# EAGLE design ETH-IO(RS485-DS18B20-Panel) (EAGLE 9.6.2)
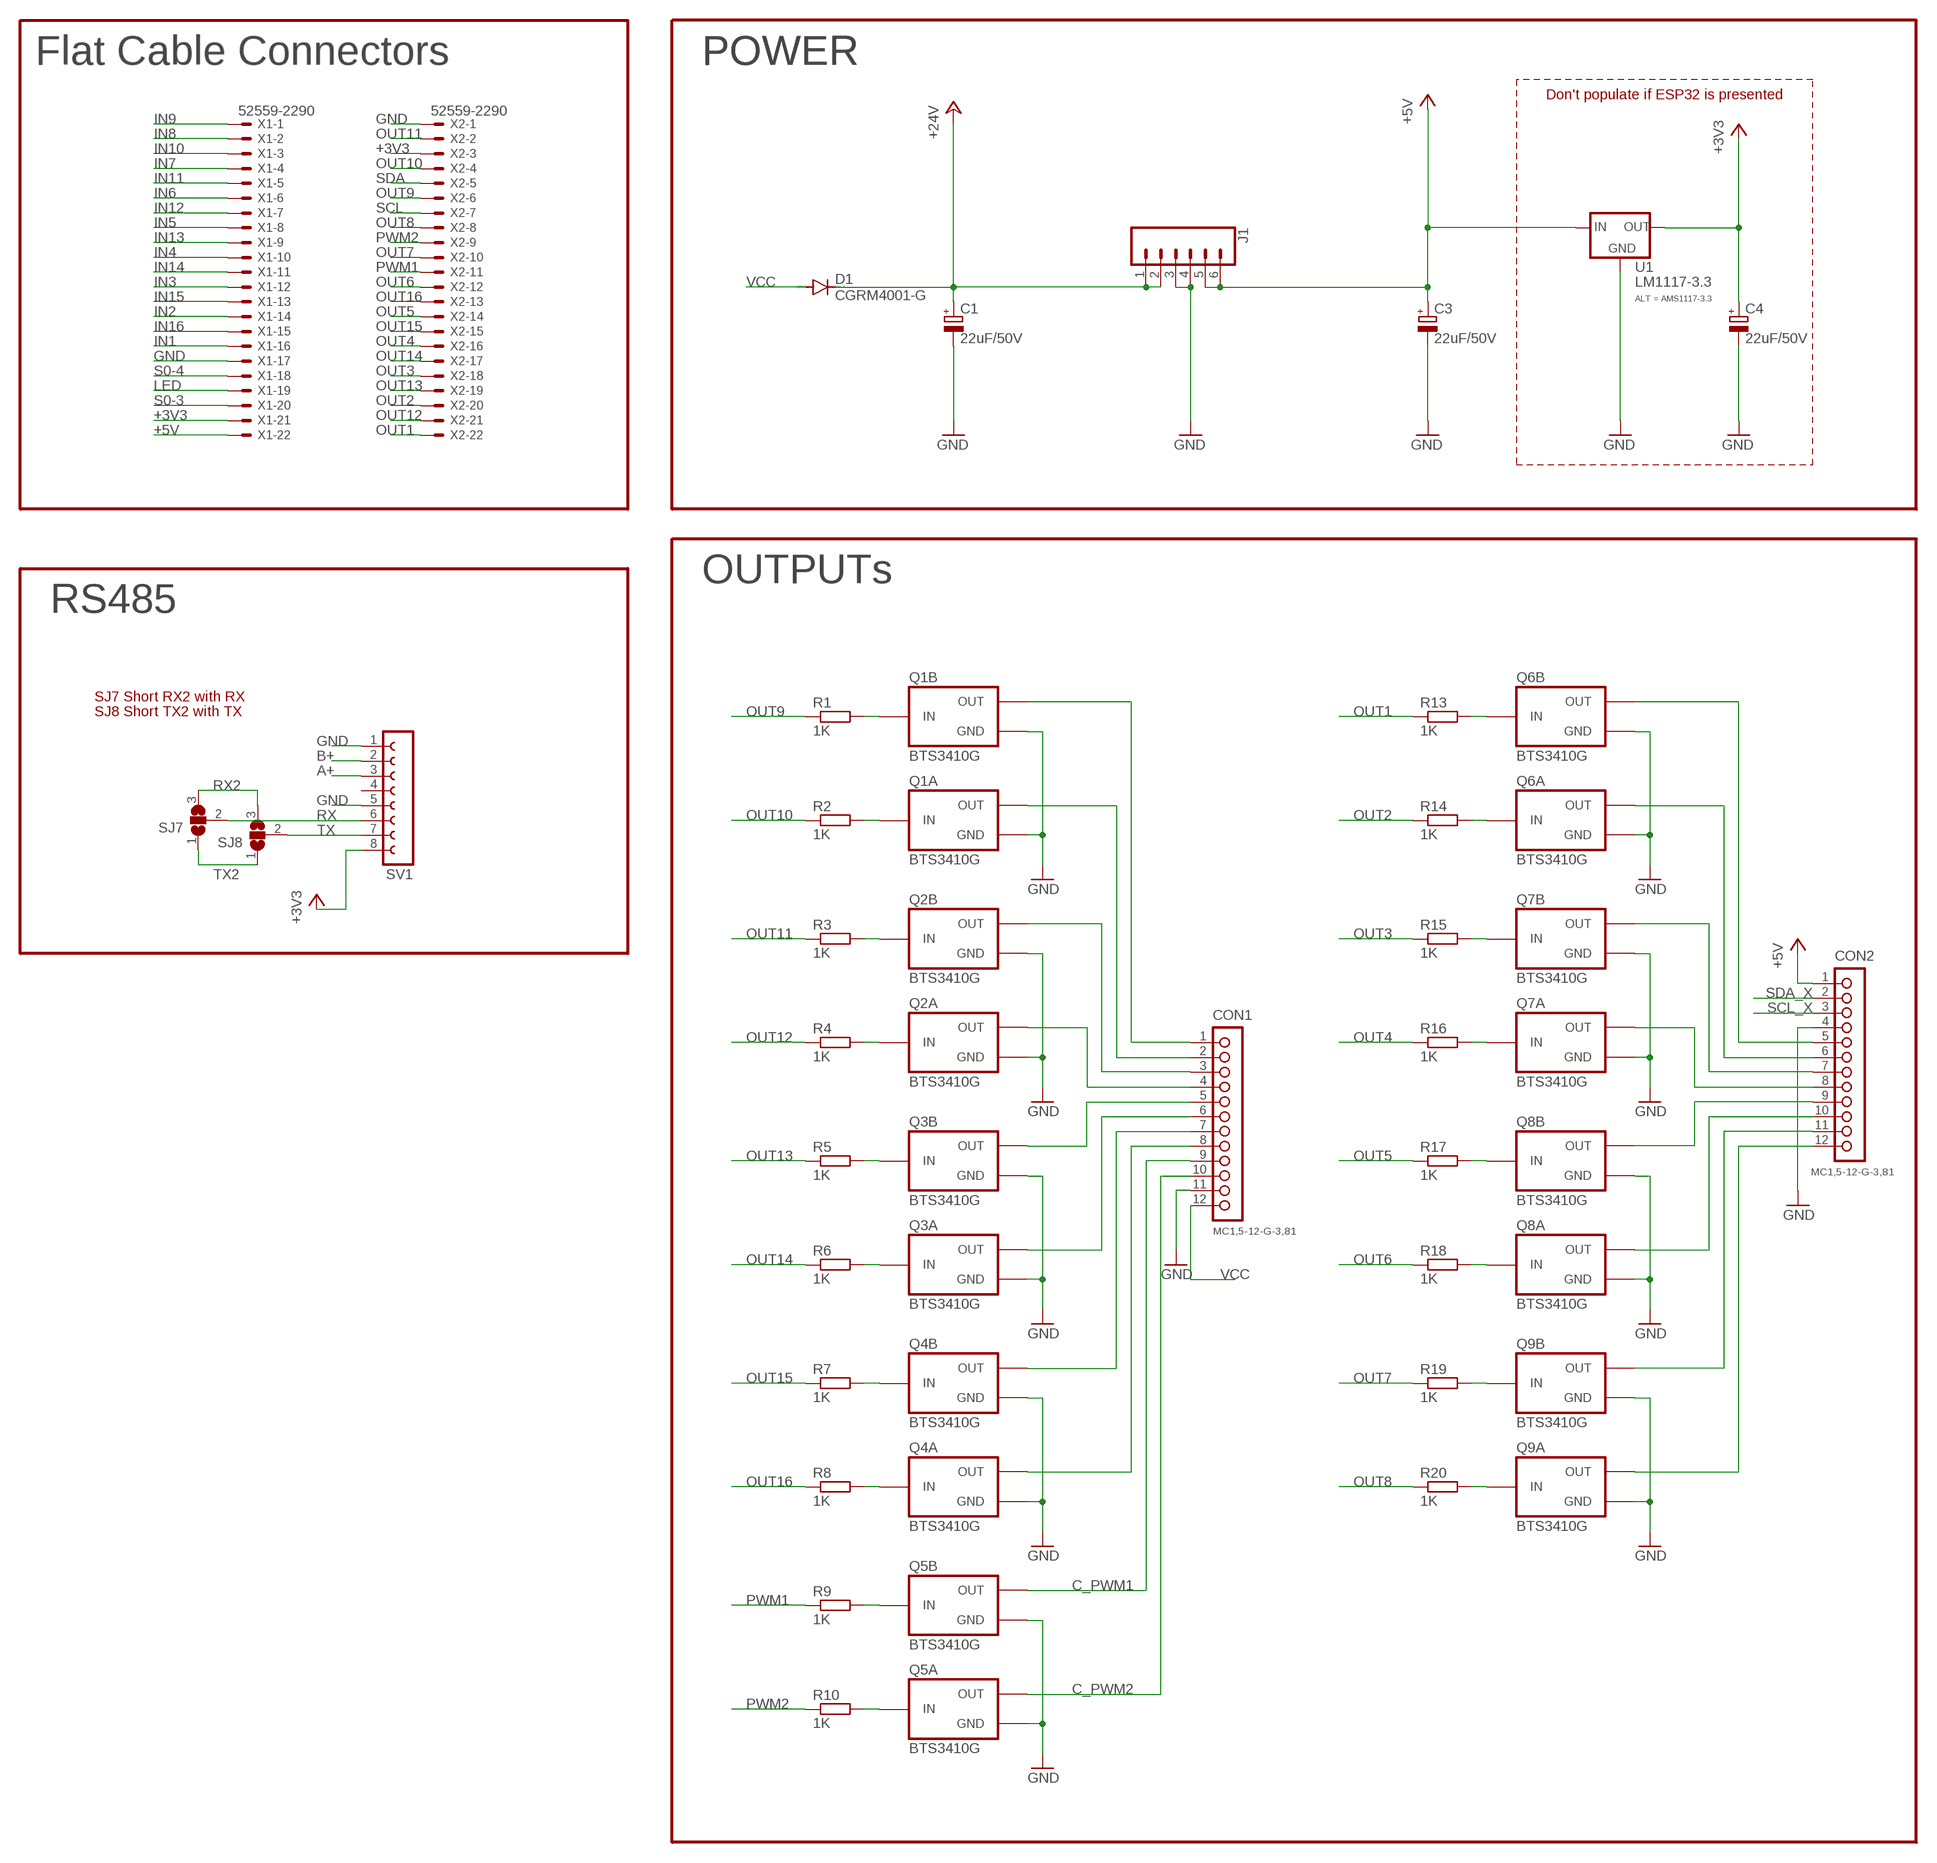
[diagram p0: schematic, sheet 1, part 1 of 2]
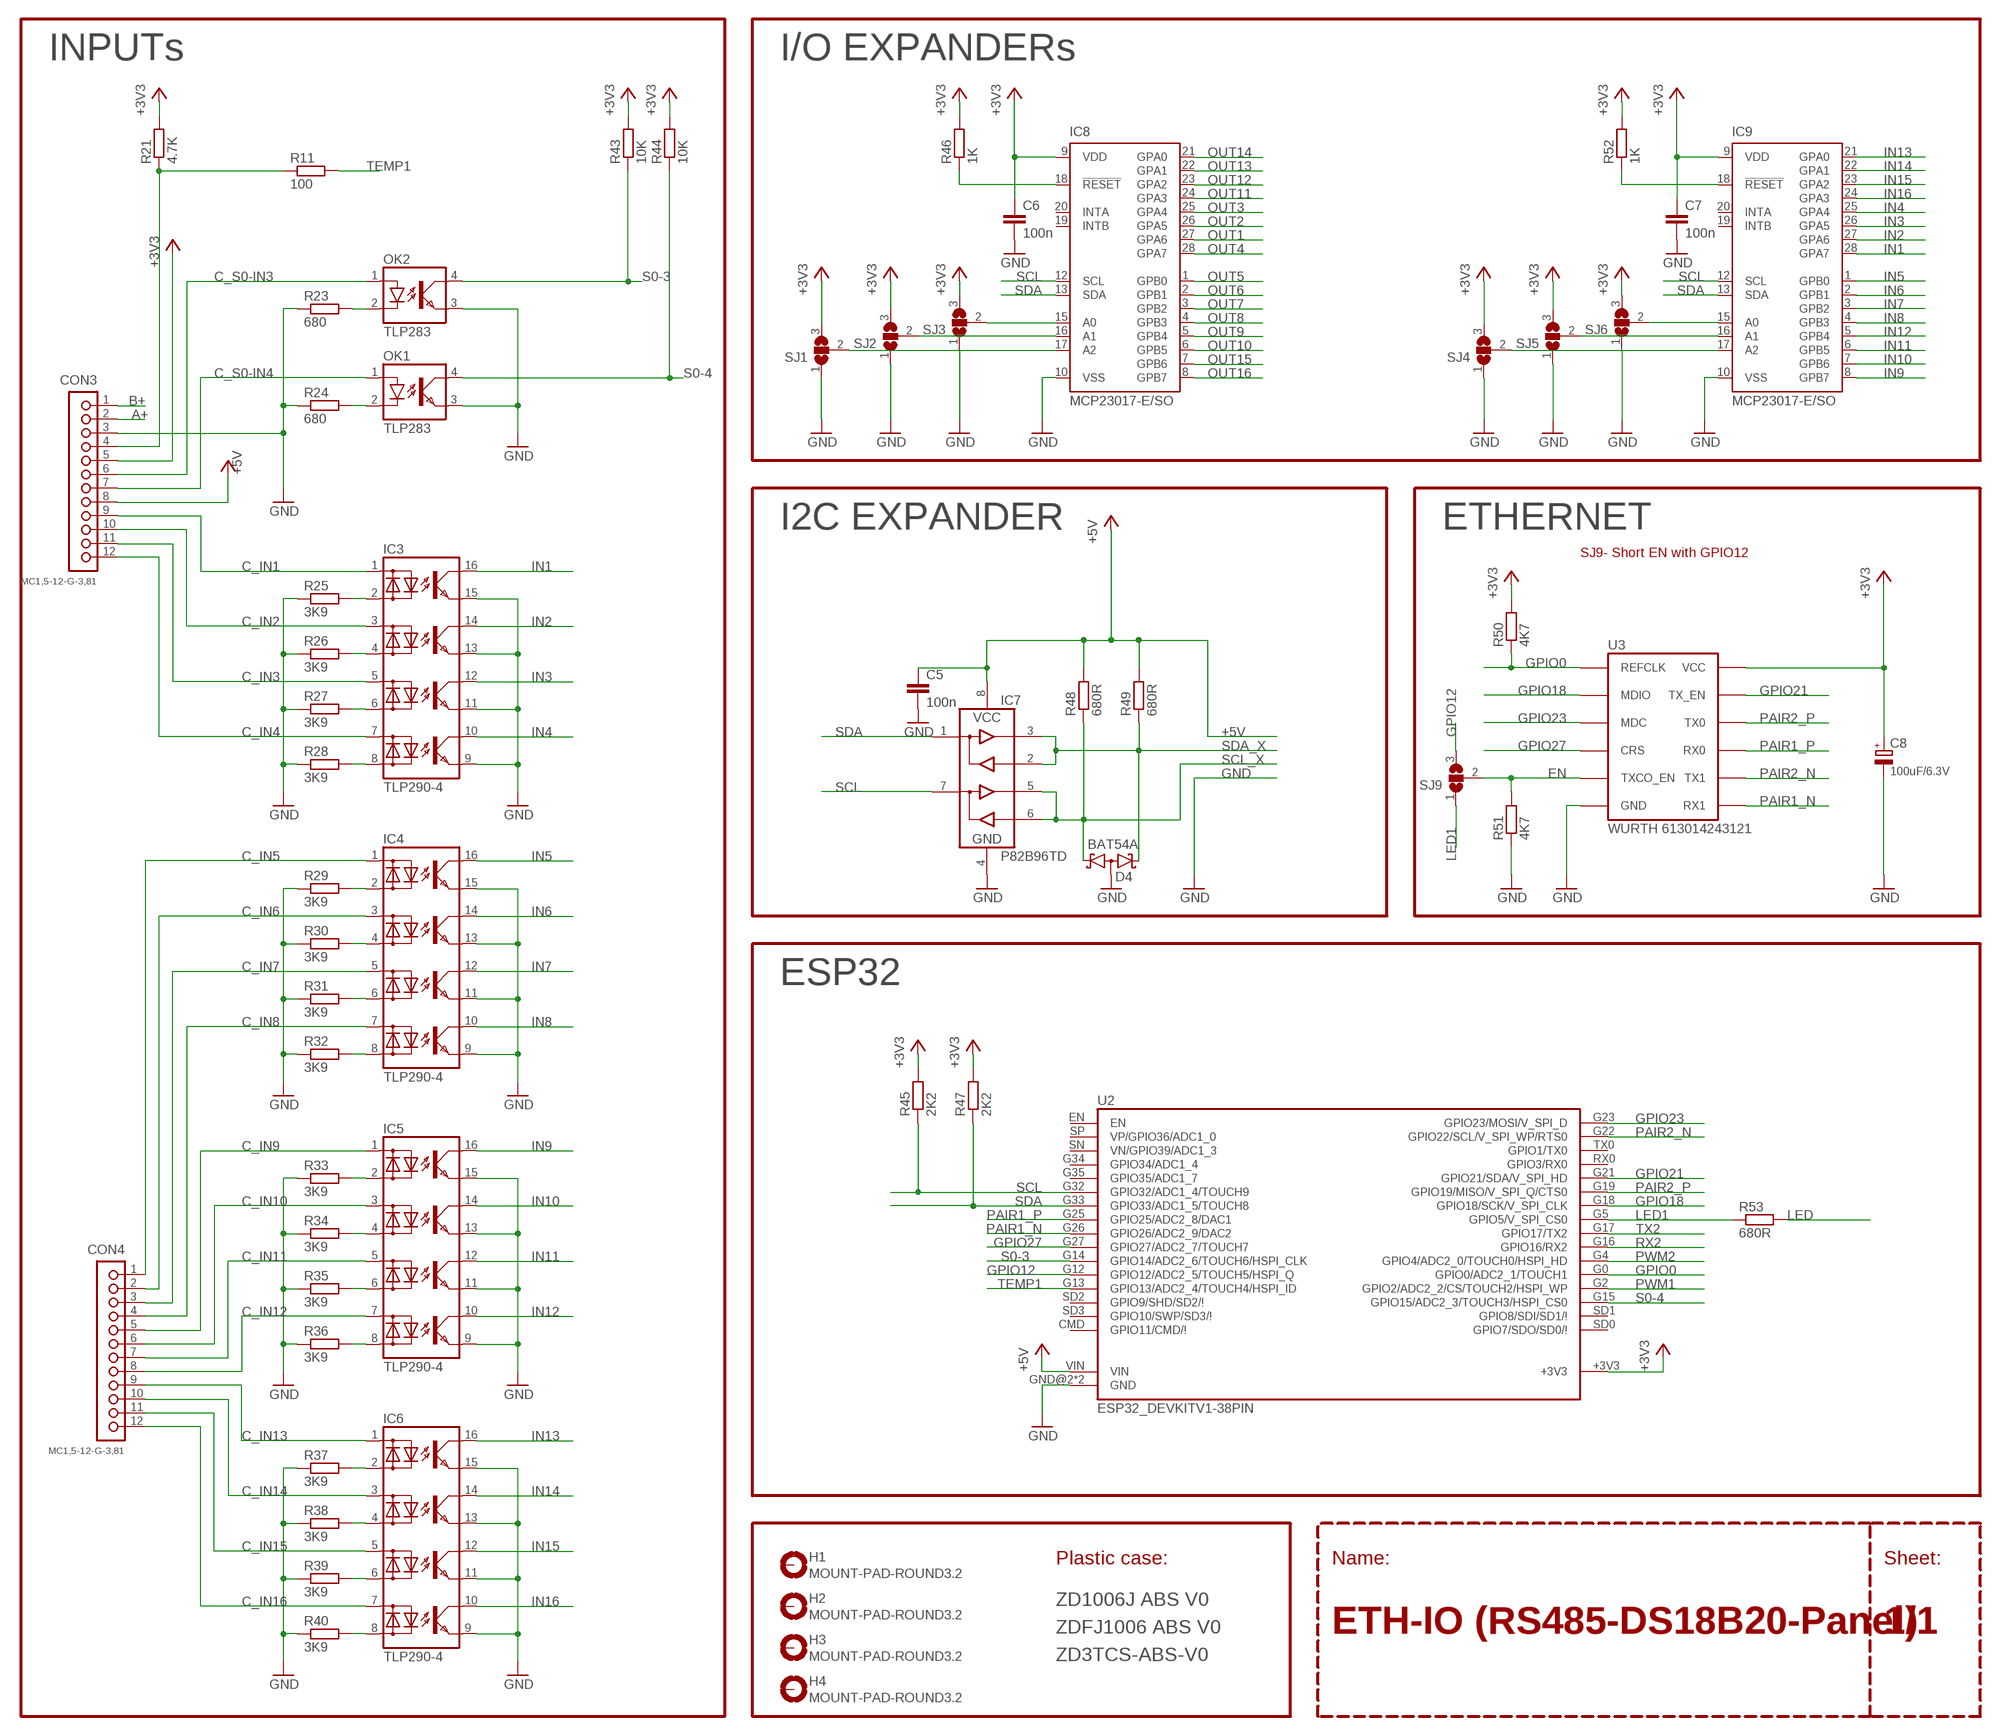
[diagram p1: schematic, sheet 1, part 2 of 2]

## Parts
C1  22uF/50V  CPOL-EUC  [PANASONIC_C]
C3  22uF/50V  CPOL-EUC  [PANASONIC_C]
C4  22uF/50V  CPOL-EUC  [PANASONIC_C]
C5  100n  C-EUC0805  [C0805]
C6  100n  C-EUC0805  [C0805]
C7  100n  C-EUC0805  [C0805]
C8  100uF/6.3V  CPOL-EUC  [PANASONIC_C]
CON1  MC1,5-12-G-3,81  [MC1,5/12-G-3,81]
CON2  MC1,5-12-G-3,81  [MC1,5/12-G-3,81]
CON3  MC1,5-12-G-3,81  [MC1,5/12-G-3,81]
CON4  MC1,5-12-G-3,81  [MC1,5/12-G-3,81]
D1  CGRM4001-G  [SOD-123_MINI-SMA]
D4  BAT54A  [SOT23]
H1  MOUNT-PAD-ROUND3.2  [3,2-PAD]
H2  MOUNT-PAD-ROUND3.2  [3,2-PAD]
H3  MOUNT-PAD-ROUND3.2  [3,2-PAD]
H4  MOUNT-PAD-ROUND3.2  [3,2-PAD]
IC3  TLP290-4  [SO16]
IC4  TLP290-4  [SO16]
IC5  TLP290-4  [SO16]
IC6  TLP290-4  [SO16]
IC7  P82B96TD  [SO08]
IC8  MCP23017-E/SO  MCP23017SO  [SO28W]
IC9  MCP23017-E/SO  MCP23017SO  [SO28W]
J1  CONN_06NO_SILK_FEMALE_PTH  [1X06_NO_SILK]
OK1  TLP283  [MINI-FLAT-4]
OK2  TLP283  [MINI-FLAT-4]
Q1  BTS3410G  [SO8]
Q2  BTS3410G  [SO8]
Q3  BTS3410G  [SO8]
Q4  BTS3410G  [SO8]
Q5  BTS3410G  [SO8]
Q6  BTS3410G  [SO8]
Q7  BTS3410G  [SO8]
Q8  BTS3410G  [SO8]
Q9  BTS3410G  [SO8]
R1  1K  R-EU_R0805  [R0805]
R2  1K  R-EU_R0805  [R0805]
R3  1K  R-EU_R0805  [R0805]
R4  1K  R-EU_R0805  [R0805]
R5  1K  R-EU_R0805  [R0805]
R6  1K  R-EU_R0805  [R0805]
R7  1K  R-EU_R0805  [R0805]
R8  1K  R-EU_R0805  [R0805]
R9  1K  R-EU_R0805  [R0805]
R10  1K  R-EU_R0805  [R0805]
R11  100  R-EU_R0805  [R0805]
R13  1K  R-EU_R0805  [R0805]
R14  1K  R-EU_R0805  [R0805]
R15  1K  R-EU_R0805  [R0805]
R16  1K  R-EU_R0805  [R0805]
R17  1K  R-EU_R0805  [R0805]
R18  1K  R-EU_R0805  [R0805]
R19  1K  R-EU_R0805  [R0805]
R20  1K  R-EU_R0805  [R0805]
R21  4.7K  R-EU_R0805  [R0805]
R23  680  R-EU_R0805  [R0805]
R24  680  R-EU_R0805  [R0805]
R25  3K9  R-EU_R0805  [R0805]
R26  3K9  R-EU_R0805  [R0805]
R27  3K9  R-EU_R0805  [R0805]
R28  3K9  R-EU_R0805  [R0805]
R29  3K9  R-EU_R0805  [R0805]
R30  3K9  R-EU_R0805  [R0805]
R31  3K9  R-EU_R0805  [R0805]
R32  3K9  R-EU_R0805  [R0805]
R33  3K9  R-EU_R0805  [R0805]
R34  3K9  R-EU_R0805  [R0805]
R35  3K9  R-EU_R0805  [R0805]
R36  3K9  R-EU_R0805  [R0805]
R37  3K9  R-EU_R0805  [R0805]
R38  3K9  R-EU_R0805  [R0805]
R39  3K9  R-EU_R0805  [R0805]
R40  3K9  R-EU_R0805  [R0805]
R43  10K  R-EU_R0805  [R0805]
R44  10K  R-EU_R0805  [R0805]
R45  2K2  R-EU_R0805  [R0805]
R46  1K  R-EU_R0805  [R0805]
R47  2K2  R-EU_R0805  [R0805]
R48  680R  R-EU_R0805  [R0805]
R49  680R  R-EU_R0805  [R0805]
R50  4K7  R-EU_R0805  [R0805]
R51  4K7  R-EU_R0805  [R0805]
R52  1K  R-EU_R0805  [R0805]
R53  680R  R-EU_R0805  [R0805]
SJ1  SJ2W  [SJ_2]
SJ2  SJ2W  [SJ_2]
SJ3  SJ2W  [SJ_2]
SJ4  SJ2W  [SJ_2]
SJ5  SJ2W  [SJ_2]
SJ6  SJ2W  [SJ_2]
SJ7  SJ2W  [SJ_2]
SJ8  SJ2W  [SJ_2]
SJ9  SJ2W  [SJ_2]
SV1  FE08-1  [FE08]
U1  LM1117-3.3  [SOT223]
U2  ESP32_DEVKITV1-38PIN  [ESP32_DEVKITV1_38PIN]
U3  WURTH 613014243121  LAN8720_ETH_BOARD  [LAN8720_ETH_BOARD]
X1  52559-2290  [52559-2290]
X2  52559-2290  [52559-2290]

## Nets
+3V3 [PWR]: C4.+ C6.1 C7.1 C8.+ CON3.5 IC8.9(VDD) IC9.9(VDD) R21.2 R43.2 R44.2 R45.2 R46.2 R47.2 R50.2 R52.2 SJ1.3 SJ2.3 SJ3.3 SJ4.3 SJ5.3 SJ6.3 SV1.8 U1.2(OUT) U1.4(OUT) U2.+3V3 U3.VCC U3.VCC@1(VCC) X1.21 X2.3
+5V [PWR]: C3.+ C5.1 CON2.1 CON3.8 IC7.8(VCC) J1.5 J1.6 R48.2 R49.2 U1.3(IN) U2.VIN X1.22
+24V [PWR]: C1.+ D1.C J1.1 J1.2
A+: CON3.2 SV1.3
B+: CON3.1 SV1.2
C_IN1: CON3.9 IC3.1(A1)
C_IN2: CON3.10 IC3.3(A2)
C_IN3: CON3.11 IC3.5(A3)
C_IN4: CON3.12 IC3.7(A4)
C_IN5: CON4.1 IC4.1(A1)
C_IN6: CON4.2 IC4.3(A2)
C_IN7: CON4.3 IC4.5(A3)
C_IN8: CON4.4 IC4.7(A4)
C_IN9: CON4.5 IC5.1(A1)
C_IN10: CON4.6 IC5.3(A2)
C_IN11: CON4.7 IC5.5(A3)
C_IN12: CON4.8 IC5.7(A4)
C_IN13: CON4.9 IC6.1(A1)
C_IN14: CON4.10 IC6.3(A2)
C_IN15: CON4.11 IC6.5(A3)
C_IN16: CON4.12 IC6.7(A4)
C_OUT1: CON2.5 Q6.5(B:OUT) Q6.6(B:OUT)
C_OUT2: CON2.6 Q6.7(A:OUT) Q6.8(A:OUT)
C_OUT3: CON2.7 Q7.5(B:OUT) Q7.6(B:OUT)
C_OUT4: CON2.8 Q7.7(A:OUT) Q7.8(A:OUT)
C_OUT5: CON2.9 Q8.5(B:OUT) Q8.6(B:OUT)
C_OUT6: CON2.10 Q8.7(A:OUT) Q8.8(A:OUT)
C_OUT7: CON2.11 Q9.5(B:OUT) Q9.6(B:OUT)
C_OUT8: CON2.12 Q9.7(A:OUT) Q9.8(A:OUT)
C_OUT9: CON1.1 Q1.5(B:OUT) Q1.6(B:OUT)
C_OUT10: CON1.2 Q1.7(A:OUT) Q1.8(A:OUT)
C_OUT11: CON1.3 Q2.5(B:OUT) Q2.6(B:OUT)
C_OUT12: CON1.4 Q2.7(A:OUT) Q2.8(A:OUT)
C_OUT13: CON1.5 Q3.5(B:OUT) Q3.6(B:OUT)
C_OUT14: CON1.6 Q3.7(A:OUT) Q3.8(A:OUT)
C_OUT15: CON1.7 Q4.5(B:OUT) Q4.6(B:OUT)
C_OUT16: CON1.8 Q4.7(A:OUT) Q4.8(A:OUT)
C_PWM1: CON1.9 Q5.5(B:OUT) Q5.6(B:OUT)
C_PWM2: CON1.10 Q5.7(A:OUT) Q5.8(A:OUT)
C_S0-IN3: CON3.6 OK2.1(A)
C_S0-IN4: CON3.7 OK1.1(A)
EN: R51.2 SJ9.2 U3.TXCO_EN
GND [PWR]: C1.- C3.- C4.- C5.2 C6.2 C7.2 C8.- CON1.11 CON2.4 CON3.3 D4.3(AA) IC3.9(EMIT4) IC3.11(EMIT3) IC3.13(EMIT2) IC3.15(EMIT1) IC4.9(EMIT4) IC4.11(EMIT3) IC4.13(EMIT2) IC4.15(EMIT1) IC5.9(EMIT4) IC5.11(EMIT3) IC5.13(EMIT2) IC5.15(EMIT1) IC6.9(EMIT4) IC6.11(EMIT3) IC6.13(EMIT2) IC6.15(EMIT1) IC7.4(GND) IC8.10(VSS) IC9.10(VSS) J1.3 J1.4 OK1.3(EMIT) OK2.3(EMIT) Q1.1(A:GND) Q1.3(B:GND) Q2.1(A:GND) Q2.3(B:GND) Q3.1(A:GND) Q3.3(B:GND) Q4.1(A:GND) Q4.3(B:GND) Q5.1(A:GND) Q5.3(B:GND) Q6.1(A:GND) Q6.3(B:GND) Q7.1(A:GND) Q7.3(B:GND) Q8.1(A:GND) Q8.3(B:GND) Q9.1(A:GND) Q9.3(B:GND) R23.1 R24.1 R25.1 R26.1 R27.1 R28.1 R29.1 R30.1 R31.1 R32.1 R33.1 R34.1 R35.1 R36.1 R37.1 R38.1 R39.1 R40.1 R51.1 SJ1.1 SJ2.1 SJ3.1 SJ4.1 SJ5.1 SJ6.1 SV1.1 SV1.5 U1.1(GND) U2.GND@2(GND) U2.GND@3(GND) U3.GND U3.GND@1(GND) X1.17 X2.1
GPIO0: R50.1 U2.G0(GPIO0/ADC2_1/TOUCH1) U3.INT(REFCLK)
GPIO12: SJ9.3 U2.G12(GPIO12/ADC2_5/TOUCH5/HSPI_Q)
GPIO18 [ETH]: U2.G18(GPIO18/SCK/V_SPI_CLK) U3.MDIO
GPIO21 [ETH]: U2.G21(GPIO21/SDA/V_SPI_HD) U3.TX_EN
GPIO23 [ETH]: U2.G23(GPIO23/MOSI/V_SPI_D) U3.MDC
GPIO27 [ETH]: U2.G27(GPIO27/ADC2_7/TOUCH7) U3.CRS
IN1: IC3.16(COL1) IC9.28(GPA7) X1.16
IN2: IC3.14(COL2) IC9.27(GPA6) X1.14
IN3: IC3.12(COL3) IC9.26(GPA5) X1.12
IN4: IC3.10(COL4) IC9.25(GPA4) X1.10
IN5: IC4.16(COL1) IC9.1(GPB0) X1.8
IN6: IC4.14(COL2) IC9.2(GPB1) X1.6
IN7: IC4.12(COL3) IC9.3(GPB2) X1.4
IN8: IC4.10(COL4) IC9.4(GPB3) X1.2
IN9: IC5.16(COL1) IC9.8(GPB7) X1.1
IN10: IC5.14(COL2) IC9.7(GPB6) X1.3
IN11: IC5.12(COL3) IC9.6(GPB5) X1.5
IN12: IC5.10(COL4) IC9.5(GPB4) X1.7
IN13: IC6.16(COL1) IC9.21(GPA0) X1.9
IN14: IC6.14(COL2) IC9.22(GPA1) X1.11
IN15: IC6.12(COL3) IC9.23(GPA2) X1.13
IN16: IC6.10(COL4) IC9.24(GPA3) X1.15
LED [PWR]: R53.2 X1.19
LED1: R53.1 SJ9.1 U2.G5(GPIO5/V_SPI_CS0)
N$1: IC9.15(A0) SJ6.2
N$2: IC8.16(A1) SJ2.2
N$3: Q1.2(A:IN) R2.2
N$4: Q1.4(B:IN) R1.2
N$5: IC8.18(!RESET) R46.1
N$6: IC9.18(!RESET) R52.1
N$7: IC8.15(A0) SJ3.2
N$8: Q5.4(B:IN) R9.2
N$9: Q5.2(A:IN) R10.2
N$10: IC9.16(A1) SJ5.2
N$11: IC3.2(C1) R25.2
N$12: IC3.4(C2) R26.2
N$13: IC3.6(C3) R27.2
N$14: IC3.8(C4) R28.2
N$15: IC4.2(C1) R29.2
N$16: IC4.4(C2) R30.2
N$17: IC4.6(C3) R31.2
N$18: IC4.8(C4) R32.2
N$19: IC5.2(C1) R33.2
N$20: IC5.4(C2) R34.2
N$21: IC5.6(C3) R35.2
N$22: IC5.8(C4) R36.2
N$23: IC6.2(C1) R37.2
N$24: IC6.4(C2) R38.2
N$25: IC6.6(C3) R39.2
N$26: IC6.8(C4) R40.2
N$27: IC9.17(A2) SJ4.2
N$28: Q2.4(B:IN) R3.2
N$29: Q2.2(A:IN) R4.2
N$30: IC8.17(A2) SJ1.2
N$31: OK2.2(C) R23.2
N$32: Q3.4(B:IN) R5.2
N$33: Q3.2(A:IN) R6.2
N$34: CON3.4 R11.1 R21.1
N$36: Q4.4(B:IN) R7.2
N$37: Q4.2(A:IN) R8.2
N$40: Q6.4(B:IN) R13.2
N$41: Q6.2(A:IN) R14.2
N$44: Q7.4(B:IN) R15.2
N$45: Q7.2(A:IN) R16.2
N$48: Q8.4(B:IN) R17.2
N$49: Q8.2(A:IN) R18.2
N$52: Q9.4(B:IN) R19.2
N$53: Q9.2(A:IN) R20.2
N$57: OK1.2(C) R24.2
OUT1: IC8.27(GPA6) R13.1 X2.22
OUT2: IC8.26(GPA5) R14.1 X2.20
OUT3: IC8.25(GPA4) R15.1 X2.18
OUT4: IC8.28(GPA7) R16.1 X2.16
OUT5: IC8.1(GPB0) R17.1 X2.14
OUT6: IC8.2(GPB1) R18.1 X2.12
OUT7: IC8.3(GPB2) R19.1 X2.10
OUT8: IC8.4(GPB3) R20.1 X2.8
OUT9: IC8.5(GPB4) R1.1 X2.6
OUT10: IC8.6(GPB5) R2.1 X2.4
OUT11: IC8.24(GPA3) R3.1 X2.2
OUT12: IC8.23(GPA2) R4.1 X2.21
OUT13: IC8.22(GPA1) R5.1 X2.19
OUT14: IC8.21(GPA0) R6.1 X2.17
OUT15: IC8.7(GPB6) R7.1 X2.15
OUT16: IC8.8(GPB7) R8.1 X2.13
PAIR1_N [RMII-RX]: U2.G26(GPIO26/ADC2_9/DAC2) U3.RX1
PAIR1_P [RMII-RX]: U2.G25(GPIO25/ADC2_8/DAC1) U3.RX0
PAIR2_N [RMII-TX]: U2.G22(GPIO22/SCL/V_SPI_WP/RTS0) U3.TX1
PAIR2_P [RMII-TX]: U2.G19(GPIO19/MISO/V_SPI_Q/CTS0) U3.TX0
PWM1: R9.1 U2.G2(GPIO2/ADC2_2/CS/TOUCH2/HSPI_WP) X2.11
PWM2: R10.1 U2.G4(GPIO4/ADC2_0/TOUCH0/HSPI_HD) X2.9
RX: SJ7.2 SV1.6
RX2: SJ7.3 SJ8.3 U2.G16(GPIO16/RX2)
S0-3: OK2.4(COL) R43.1 U2.G14(GPIO14/ADC2_6/TOUCH6/HSPI_CLK) X1.20
S0-4: OK1.4(COL) R44.1 U2.G15(GPIO15/ADC2_3/TOUCH3/HSPI_CS0) X1.18
SCL [I2C]: IC7.7(SY) IC8.12(SCL) IC9.12(SCL) R45.1 U2.G32(GPIO32/ADC1_4/TOUCH9) X2.7
SCL_X [I2C_DIFF]: CON2.3 D4.1(K1) IC7.5(TY) IC7.6(RY) R48.1
SDA [I2C]: IC7.1(SX) IC8.13(SDA) IC9.13(SDA) R47.1 U2.G33(GPIO33/ADC1_5/TOUCH8) X2.5
SDA_X [I2C_DIFF]: CON2.2 D4.2(K2) IC7.2(RX) IC7.3(TX) R49.1
TEMP1: R11.2 U2.G13(GPIO13/ADC2_4/TOUCH4/HSPI_ID)
TX: SJ8.2 SV1.7
TX2 [ETH]: SJ7.1 SJ8.1 U2.G17(GPIO17/TX2)
VCC [PWR]: CON1.12 D1.A
Unconnected: H1.B3,2(MOUNT) H2.B3,2(MOUNT) H3.B3,2(MOUNT) H4.B3,2(MOUNT) IC8.19(INTB) IC8.20(INTA) IC9.19(INTB) IC9.20(INTA) SV1.4 U2.CMD(GPIO11/CMD/!) U2.EN U2.G34(GPIO34/ADC1_4) U2.G35(GPIO35/ADC1_7) U2.RX0(GPIO3/RX0) U2.SD0(GPIO7/SDO/SD0/!) U2.SD1(GPIO8/SDI/SD1/!) U2.SD2(GPIO9/SHD/SD2/!) U2.SD3(GPIO10/SWP/SD3/!) U2.SN(VN/GPIO39/ADC1_3) U2.SP(VP/GPIO36/ADC1_0) U2.TX0(GPIO1/TX0)

## Notes on the sheet
- Flat Cable Connectors | POWER | POWER | INPUTs | I/O EXPANDERs
- Don't populate if ESP32 is presented
- I2C EXPANDER | ETHERNET
- OUTPUTs
- SJ9- Short EN with GPIO12
- RS485
- SJ7 Short RX2 with RX
- SJ8 Short TX2 with TX
- ESP32
- Plastic case: | Name: | Sheet:
- ZD1006J ABS V0
- ZDFJ1006 ABS V0 | ETH-IO (RS485-DS18B20-Panel)
- ZD3TCS-ABS-V0

## Library data of the parts
C1 C3 C4 C8 = rcl:CPOL-EU: POLARIZED CAPACITOR, European symbol; SPICEPREFIX: C
C5-C7 = rcl:C-EU: CAPACITOR, European symbol; SPICEPREFIX: C
CON1-CON4 = my-con-terminal:MC1,5-12-G-?: 12P PCB plug-in terminal
D1 = diode:CGRM400*-G: Molded plasitc,JEDEC SOD-123/Mini SMA Source: Comchip CGRM4001-G.pdf
D4 = diode:BAT54A: Schottky Diodes Source: Fairchild .. BAT54.pdf
H1-H4 = holes:MOUNT-PAD-ROUND: MOUNTING PAD, round
IC3-IC6 = my-opto:TLP290-4: Quad Channel Optocoupler with diode
IC7 = my-ic:P82B96?: Dual bidirectional bus buffer; MSL: 1
IC8 IC9 = microchip:MCP23017: http://ww1.microchip.com/downloads/en/DeviceDoc/21952a.pdf Source: http://ww1.microchip.com/downloads/en/DeviceDoc/21952a.pdf; MF: MICROCHIP; MPN: MCP23017-E/SO; OC_FARNELL: 1332087; OC_NEWARK: 31K2958
J1 = SparkFun-Connectors:CONN_06: Multi connection point. Often used as Generic Header-pin footprint for 0.1 inch spaced/style header connections On any of the 0.1 inch spaced packages, you can populate with these: Break Away Headers - Straight <https://www.sparkfun.com/products/116> (PRT-00116) Break Away Male Headers - Right Angle <https://www.sparkfun.com/products/553> (PRT-00553) Female Headers <https://www.sparkfun.com/products/115> (PRT-00115) Break Away Headers - Machine Pin <https://www.sparkfun.com/products/117> (PRT-00117) Break Away Female Headers - Swiss Machine Pin <https://www.sparkfun.com/products/743> (PRT-00743) Arduino Stackable Header - 6 Pin <https://www.sparkfun.com/products/9280> (PRT-09280) Screw Terminals 2.54mm Pitch (6-Pin) <https://www.sparkfun.com/products/16499> (PRT-16499) For SCREWTERMINALS and SPRING TERMINALS visit here: Screw Terimnals on SparkFun.com <https://www.sparkfun.com/search/results?term=Screw+Terminals> (5mm/3.5mm/2.54mm spacing) This device is also useful as a general connection point to wire up your design to another part of your project. Our various solder wires solder well into these plated through hole pads. Hook-Up Wire - Assortment (Stranded, 22 AWG) <https://www.sparkfun.com/products/11375> (PRT-11375) Hook-Up Wire - Assortment (Solid Core, 22 AWG) <https://www.sparkfun.com/products/11367> (PRT-11367) View the entire wire category on our website here <https://www.sparkfun.com/categories/141>; PROD_ID: CONN-08437
OK1 OK2 = optocoupler:TLP283: TOSHIBA PHOTOCOUPLER GaAs IRED & PHOTO-TRANSISTOR Source: http://www.semicon.toshiba.co.jp/td/en/Opto/Photocoupler/en_20050928_TLP283_datasheet.pdf; OC_FARNELL: unknown; OC_NEWARK: unknown
Q1-Q9 = my-load-switch:BTS3410G: Smart Low Side Power Switch
R1-R11 R13-R21 R23-R40 R43-R53 = rcl:R-EU_: RESISTOR, European symbol; SPICEPREFIX: R
SJ1-SJ9 = jumper:SJ2W: SMD solder JUMPER
SV1 = con-lsta:FE08-1: FEMALE HEADER; OC_FARNELL: unknown; OC_NEWARK: unknown
U1 = my-power:LM1117-*: LDO regulator; ALT: AMS1117-3.3
U2 = tmp:ESP32_DEVKITV1-38PIN
U3 = my-modules:LAN8720_ETH_BOARD
X1 X2 = con-molex:52559-2290: FFC/FPC-to-Board 0.50mm (.020") SMT, Vertical, ZIF Receptacle Source: http://www.molex.com/product/ffc/52559.html; MF: MOLEX; MPN: 52559-2290; OC_FARNELL: unknown; OC_NEWARK: 92M6193

## Net classes
0 default: width 0.254 mm, drill 0.5 mm
1 ETH: width 0.254 mm, drill 0.35 mm
2 RMII-TX: width 0.254 mm, drill 0.35 mm
3 RMII-RX: width 0.254 mm, drill 0.35 mm
4 I2C: width 0.254 mm, drill 0.35 mm
5 PWR: width 0.305 mm, drill 0.5 mm
6 I2C_DIFF: width 0.254 mm, drill 0.5 mm

## Board
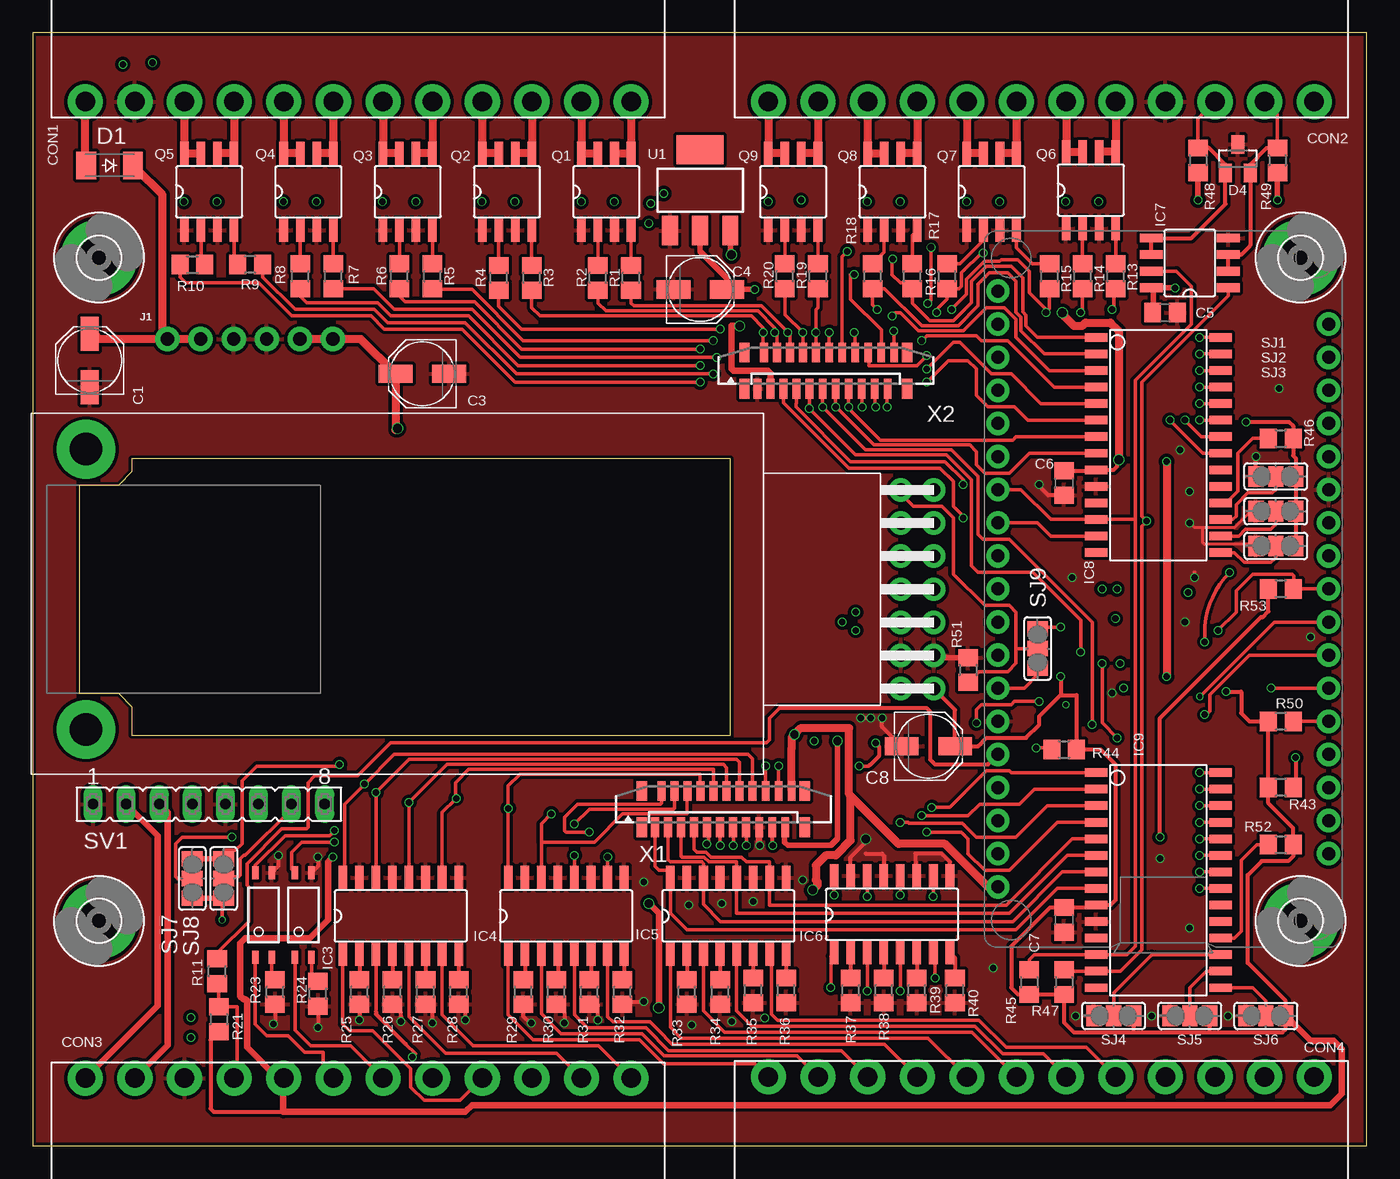
[diagram p2: board, top side]
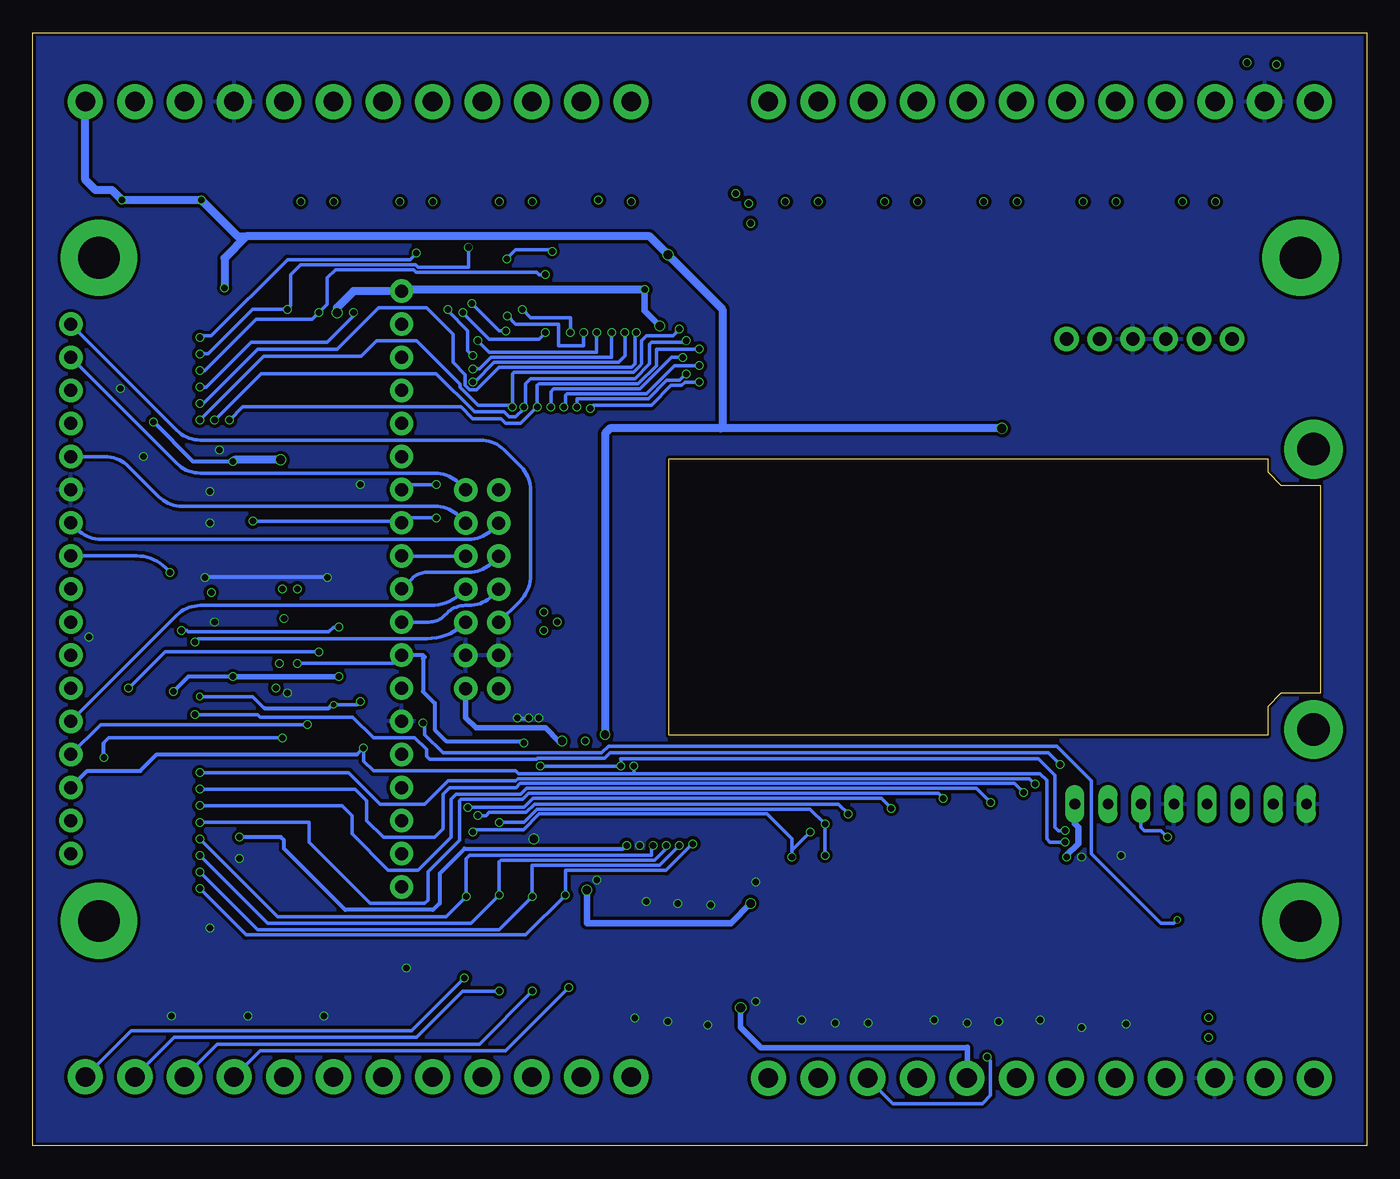
[diagram p3: board, bottom side, seen from below]

Size 102.45 x 85.45 mm. Coordinates in mm from the lower left corner, seen from the top.
Outline: 0,85.45 0,0 102.45,0 102.45,85.45 0,85.45
Copper layers (1*16): Top 0.035mm / dielectric 1.6mm / Bottom 0.035mm
Design rules "jlcpcb-2layers": minimum track width 5mil, minimum drill 0.3mm, track to track 5mil, track to pad 5mil, pad to pad 5mil, via to via 5mil, smd to smd 5mil, copper to edge 0.2mm, drill to drill 6mil, minimum pad ring 10mil, minimum via ring 3mil, stop-mask expansion 4mil, vias tented up to drill 0mil, thermal gap 10mil

### Footprints (pad centres in the part's own frame; a part is rotated, then mirrored left to right if it is on the bottom)
PANASONIC_C = smd 2.6 x 1.4: + 2.05,0; - -2.05,0
C0805 = smd 1.3 x 1.5: 1 -0.95,0; 2 0.95,0
MC1,5/12-G-3,81 = drill 1.5: 1 -20.955,8; 2 -17.145,8; 3 -13.335,8; 4 -9.525,8; 5 -5.715,8; 6 -1.905,8; 7 1.905,8; 8 5.715,8; 9 9.525,8; 10 13.335,8; 11 17.145,8; 12 20.955,8
SOD-123_MINI-SMA = smd 1.5 x 2.1: A 1.8,0; C -1.8,0
SOT23 = smd 1 x 1.4: 1 -0.95,-1.1; 2 0.95,-1.1; 3 0,1.1
3,2-PAD = drill 3.2 pad 5.842: B3,2 0,0
SO16 = smd 0.66 x 1.778: 1 -4.445,-2.946; 2 -3.175,-2.946; 3 -1.905,-2.946; 4 -0.635,-2.946; 5 0.635,-2.946; 6 1.905,-2.946; 7 3.175,-2.946; 8 4.445,-2.946; 9 4.445,2.946; 10 3.175,2.946; 11 1.905,2.946; 12 0.635,2.946; 13 -0.635,2.946; 14 -1.905,2.946; 15 -3.175,2.946; 16 -4.445,2.946
SO08 = smd 0.66 x 1.778: 1 -1.905,-2.946; 2 -0.635,-2.946; 3 0.635,-2.946; 4 1.905,-2.946; 5 1.905,2.946; 6 0.635,2.946; 7 -0.635,2.946; 8 -1.905,2.946
SO28W = smd 0.65 x 1.7: 1 -7.62,-4.78; 2 -6.35,-4.78; 3 -5.08,-4.78; 4 -3.81,-4.78; 5 -2.54,-4.78; 6 -1.27,-4.78; 7 0,-4.78; 8 1.27,-4.78; 9 2.54,-4.78; 10 3.81,-4.78; 11 5.08,-4.78; 12 6.35,-4.78; 13 7.62,-4.78; 14 8.89,-4.78; 15 8.89,4.78; 16 7.62,4.78; 17 6.35,4.78; 18 5.08,4.78; 19 3.81,4.78; 20 2.54,4.78; 21 1.27,4.78; 22 0,4.78; 23 -1.27,4.78; 24 -2.54,4.78; 25 -3.81,4.78; 26 -5.08,4.78; 27 -6.35,4.78; 28 -7.62,4.78
1X06_NO_SILK = drill 1.016 pad 1.88: 1 0,0; 2 2.54,0; 3 5.08,0; 4 7.62,0; 5 10.16,0; 6 12.7,0
MINI-FLAT-4 = smd 1 x 0.5: 1 -3.24,0.635; 2 -3.24,-0.635; 3 3.24,-0.635; 4 3.24,0.635
SO8 = smd 0.66 x 1.778: 1 -1.905,-2.946; 2 -0.635,-2.946; 3 0.635,-2.946; 4 1.905,-2.946; 5 1.905,2.946; 6 0.635,2.946; 7 -0.635,2.946; 8 -1.905,2.946
R0805 = smd 1.3 x 1.5: 1 -0.95,0; 2 0.95,0
SJ_2 = smd 1.168 x 1.6: 1 -1.524,0; 2 0,0; 3 1.524,0
FE08 = drill 0.813 long: 1 -8.89,0; 2 -6.35,0; 3 -3.81,0; 4 -1.27,0; 5 1.27,0; 6 3.81,0; 7 6.35,0; 8 8.89,0
SOT223 = smd 1.219 x 2.235: 1 -2.311,-3.099; 2 0,-3.099; 3 2.311,-3.099 | smd 3.6 x 2.2: 4 0,3.099
ESP32_DEVKITV1_38PIN = drill 1: +3V3 -12.7,22.86; CMD -12.7,-20.32; EN -12.7,20.32; G0 12.7,-10.16; G2 12.7,-12.7; G4 12.7,-7.62; G5 12.7,0; G12 -12.7,-7.62; G13 -12.7,-12.7; G14 -12.7,-5.08; G15 12.7,-15.24; G16 12.7,-5.08; G17 12.7,-2.54; G18 12.7,2.54; G19 12.7,5.08; G21 12.7,10.16; G22 12.7,17.78; G23 12.7,20.32; G25 -12.7,2.54; G26 -12.7,0; G27 -12.7,-2.54; G32 -12.7,7.62; G33 -12.7,5.08; G34 -12.7,12.7; G35 -12.7,10.16; GND@2 12.7,7.62; GND@3 -12.7,-10.16; RX0 12.7,12.7; SD0 12.7,-20.32; SD1 12.7,-17.78; SD2 -12.7,-15.24; SD3 -12.7,-17.78; SN -12.7,15.24; SP -12.7,17.78; TX0 12.7,15.24; VIN -12.7,-22.86
LAN8720_ETH_BOARD = drill 1: CRS 10.56,0; GND 13.1,-5.08; GND@1 10.56,-5.08; INT 13.1,0; MDC 10.56,-2.54; MDIO 13.1,-2.54; RX0 13.1,2.54; RX1 10.56,2.54; TX0 10.56,5.08; TX1 13.1,7.62; TX_EN 13.1,5.08; TXCO_EN 10.56,7.62; VCC 13.1,-7.62; VCC@1 10.56,-7.62 | drill 2.5: H1 -52,-10.75; H2 -52,10.75
52559-2290 = smd 0.6 x 1.5: 1 -5.25,-1.4; 2 -4.75,1.4; 3 -4.25,-1.4; 4 -3.75,1.4; 5 -3.25,-1.4; 6 -2.75,1.4; 7 -2.25,-1.4; 8 -1.75,1.4; 9 -1.25,-1.4; 10 -0.75,1.4; 11 -0.25,-1.4; 12 0.25,1.4; 13 0.75,-1.4; 14 1.25,1.4; 15 1.75,-1.4; 16 2.25,1.4; 17 2.75,-1.4; 18 3.25,1.4; 19 3.75,-1.4; 20 4.25,1.4; 21 4.75,-1.4; 22 5.25,1.4 | smd 0.8 x 1.5: M1 -6.25,-1.4; M2 6.25,-1.4; M3 6.25,1.4; M4 -6.25,1.4

### Placement (x,y rotation side)
C1  4.39,60.27 90 top
C3  29.92,59.26 180 top
C4  51.26,65.73 0 top
C5  86.94,63.96 0 top
C6  79.2,50.88 270 top
C7  79.2,17.35 270 top
C8  68.78,30.68 0 top
CON1  25,88.15 180 top
CON2  77.45,88.15 180 top
CON3  25,-2.8 0 top
CON4  77.45,-2.7 0 top
D1  5.92,75.26 180 top
D4  92.53,75.77 0 top
H1  5.1,17.28 0 top
H2  97.35,17.28 0 top
H3  97.35,68.17 0 top
H4  5.1,68.17 0 top
IC3  28.27,17.65 0 top
IC4  40.97,17.65 0 top
IC5  53.42,17.65 0 top
IC6  65.99,17.78 0 top
IC7  88.85,67.77 90 top
IC8  86.44,54.43 270 top
IC9  86.44,21.03 270 top
J1  10.36,61.93 0 top
OK1  20.78,17.73 90 top
OK2  17.73,17.73 90 top
Q1  44.04,73.23 0 top
Q2  36.42,73.23 0 top
Q3  28.8,73.23 0 top
Q4  21.18,73.23 0 top
Q5  13.56,73.23 0 top
Q6  81.25,73.35 0 top
Q7  73.63,73.23 0 top
Q8  66.01,73.23 0 top
Q9  58.39,73.23 0 top
R1  45.95,66.62 90 top
R2  43.41,66.62 90 top
R3  38.33,66.62 90 top
R4  35.79,66.62 90 top
R5  30.71,66.75 90 top
R6  28.17,66.75 90 top
R7  23.09,66.75 90 top
R8  20.55,66.75 90 top
R9  16.71,67.64 180 top
R10  12.27,67.64 0 top
R11  14.17,13.41 90 top
R13  83.16,66.75 90 top
R14  80.62,66.75 90 top
R15  78.08,66.75 90 top
R16  70.21,66.75 90 top
R17  67.54,66.75 90 top
R18  64.49,66.75 90 top
R19  60.3,66.75 90 top
R20  57.76,66.75 90 top
R21  14.3,9.73 270 top
R23  18.62,11.81 90 top
R24  21.92,11.68 90 top
R25  25.1,11.81 90 top
R26  27.64,11.81 90 top
R27  30.18,11.81 90 top
R28  32.71,11.81 90 top
R29  37.67,11.81 90 top
R30  40.21,11.81 90 top
R31  42.75,11.81 90 top
R32  45.29,11.81 90 top
R33  50.24,11.81 90 top
R34  52.78,11.81 90 top
R35  55.32,11.94 90 top
R36  57.86,11.94 90 top
R37  62.81,11.94 90 top
R38  65.35,11.94 90 top
R39  67.89,11.94 90 top
R40  70.81,11.94 90 top
R43  95.83,27.51 180 top
R44  79.2,30.43 0 top
R45  76.53,12.57 270 top
R46  95.83,54.3 0 top
R47  79.2,12.57 270 top
R48  89.48,75.64 270 top
R49  95.58,75.64 270 top
R50  95.83,32.59 180 top
R51  71.83,36.52 270 top
R52  95.83,23.12 0 top
R53  95.83,42.75 180 top
SJ1  95.45,51.38 0 top
SJ2  95.45,48.72 0 top
SJ3  95.45,46.05 0 top
SJ4  83.01,9.98 0 top
SJ5  88.85,9.98 0 top
SJ6  94.69,9.98 0 top
SJ7  12.27,20.52 90 top
SJ8  14.68,20.52 90 top
SJ9  77.16,38.18 270 top
SV1  13.54,26.24 0 top
U1  51.26,73.35 0 top
U2  86.82,42.75 0 top
U3  56.1,42.73 0 top
X1  53.04,25.86 0 top
X2  60.91,59.51 0 top

### Tracks (layer width: path | path; a pad name or v marks a point on that pad's centre or on a via)
+3V3  (via drill 0.5, 0.65, 0.7)
  Top 0.305: C6.1 81.59,51.83 IC8.9 83.01,51.89 83.26,52.15 83.26,52.53 | v93.17,55.58 96.47,55.58 96.78,55.26 R46.2 96.78,52.97 96.98,52.78 SJ1.3 SJ2.3 SJ3.3 | SJ4.3 84.53,8.71 | 84.53,8.71 79.96,8.71 79.2,9.47 R47.2 R45.2 75.65,11.62 75.13,12.14 75.13,15.32 78.11,18.3 C7.1 81.19,18.3 arc45 IC9.9 82.75,18.49 83.13,18.87 83.13,29.29 81.99,30.43 R44.2 80.15,34.6 78.94,34.6 78.94,34.62 | 84.53,8.71 90.37,8.71 | 90.37,8.71 SJ5.3 | 90.37,8.71 95.96,8.71 96.21,8.97 SJ6.3 96.21,11.12 93.29,14.05 93.29,20.78 94.37,21.85 96.4,21.85 96.78,22.23 R52.2 96.78,24.4 94.88,26.3 R43.2 R50.2 93.42,32.59 92.79,33.22 92.79,34.87 v91.64,34.87 | U3.VCC 70.83,33.47 C8.+ 72.61,30.68 73.25,31.32 76.28,31.32 77.29,32.33 77.29,32.97 78.94,34.62 | v78.94,36.02 78.94,34.62 | R21.2 13.66,8.14 13.66,2.87 13.92,2.62 19.25,2.62
  Top 0.406: U1.2 51.26,68.66 53.31,66.61 C4.+ v55.45,65.73 | v61.8,31.06 61.8,23.57 61.29,23.06 57.99,23.06 57.73,23.32 57.73,24.41 X1.21
  Top 0.508: X2.3 56.66,59.32 56.46,59.51 53.8,59.51 53.67,59.64 53.67,62.94 v54.3,62.94 | SJ6.3 98.12,8.08 99.9,8.08 100.53,7.44 100.53,4.01 99.64,3.12 33.73,3.12 33.22,2.62 19.25,2.62 19.25,5.17 | 19.25,5.17 CON3.5 | v23.06,22.17 22.68,21.79 22.68,17.35 21.29,15.95 16.33,15.95 15.95,15.57 15.95,11.51 16.21,11.25 16.33,11.25 16.46,11.12 16.46,7.57 18.86,5.17 19.25,5.17 | v83.39,52.65 83.26,52.53
  Top 0.61: v79.07,63.96 79.07,63.83 79.96,62.94 80.59,62.94 80.85,63.2 82.75,63.2 83.39,62.56 v83.39,52.65 | v87.07,52.53 v87.07,36.02
  Bottom 0.305: v87.07,52.53 90.12,52.53 v93.17,55.58 | v87.07,36.02 90.5,36.02 v91.64,34.87 | U2.+3V3 73.99,65.73
  Bottom 0.406: U3.VCC 69.2,32.88 68.4,32.08 63.07,32.08 62.05,31.06 v61.8,31.06 | v87.07,36.02 v78.94,36.02
  Bottom 0.508: v54.3,62.94 55.45,64.08 v55.45,65.73 | SV1.8 22.43,24.71 22.17,24.46 22.17,23.19 23.06,22.3 v23.06,22.17
  Bottom 0.61: 73.99,65.73 v55.45,65.73 | v79.07,63.96 79.07,64.34 77.8,65.61 U2.+3V3 | v83.39,52.65 86.94,52.65 v87.07,52.53
+5V  (via drill 0.5, 0.65, 0.7)
  Top 0.406: v53.67,68.4 53.57,68.5 U1.3 | C5.1 86.05,63.9 86.05,65.71 IC7.8 v87.71,65.86 | R48.2 v89.48,72.59 | R49.2 v95.58,72.59 | C3.+ 27.87,59.13 27.75,59.25 C3.+
  Top 0.508: v48.08,10.62 48.08,17.86 v47.32,18.62
  Top 0.61: J1.5 J1.6 25.2,61.93 C3.+ 27.87,54.96 27.89,54.94 v28.02,55.07 | X1.22 58.29,30.56 | 58.29,30.56 58.29,31.36 v58.5,31.57 59,32.08 62.69,32.08 62.69,27 62.81,26.87 | U2.VIN 73.35,19.89 70.05,23.19 66.5,23.19 62.81,26.87 | 62.81,26.87 62.81,23.44 61.67,22.3 60.91,22.3 60.15,21.54 60.15,20.4 60.27,20.27 60.27,20.02 v59.89,19.63 | 58.29,30.56
  Bottom 0.406: CON3.8 30.68,5.23 30.68,7.57 30.71,7.54 46.53,7.54 48.08,9.09 v48.08,10.62
  Bottom 0.508: v47.32,18.62 48.84,17.09 59.89,17.09 v59.89,19.63
  Bottom 0.61: v28.02,55.07 49.61,55.07 | 49.61,55.07 58.12,55.07 58.5,54.69 v58.5,31.57 | 49.61,55.07 49.48,55.19 49.48,64.21 v53.67,68.4 55.07,69.8 86.05,69.8 | 86.05,69.8 87.71,68.15 v87.71,65.86 | 86.05,69.8 86.69,69.8 v89.48,72.59 v95.58,72.59 96.34,73.35 97.61,73.35 98.41,74.15 CON2.1
+24V
  Top 0.406: D1.C 7.96,75.02
  Top 0.61: C1.+ 4.78,62.32 5.17,61.93 J1.1 | J1.2 J1.1 | J1.1 9.98,62.31 9.98,73 7.96,75.02
A+
  Top 0.508: CON3.2 10.36,7.71 10.36,25.6 SV1.3
B+
  Top 0.508: SV1.2 9.6,23.83 9.6,10.76 CON3.1
C_IN1
  Top 0.254: IC3.1 23.83,9.35 24.33,8.84 26.11,8.84 29.03,5.92 29.03,4.52 30.05,3.5 32.83,3.5 CON3.9
C_IN2  (via drill 0.5)
  Top 0.254: IC3.3 26.37,10.31 | 28.65,7.82 29.41,7.06 v29.16,6.81
  Top 0.305: 26.37,10.31 26.37,10.11 28.65,7.82
  Bottom 0.254: v29.16,6.81 28.91,6.55 28.91,3.89 29.54,3.25 36.39,3.25 CON3.10
C_IN3
  Top 0.254: IC3.5 28.91,9.93 31.72,7.11 40.23,7.11 CON3.11
C_IN4
  Top 0.254: IC3.7 31.45,10.06 33.81,7.7 43.46,7.7 CON3.12
C_IN5
  Top 0.254: IC4.1 36.52,10.06 38.43,8.15 46.61,8.15 48.45,6.32 55.48,6.32 CON4.1
C_IN6
  Top 0.254: IC4.3 39.07,10.13 40.59,8.61 46.79,8.61 48.46,6.93 58.67,6.93 CON4.2
C_IN7
  Top 0.254: IC4.5 41.61,10.06 42.6,9.07 47.09,9.07 48.84,7.31 62.1,7.31 CON4.3
C_IN8
  Top 0.254: IC4.7 44.15,9.93 44.55,9.53 47.4,9.53 48.02,8.9 | 48.02,8.9 49.1,7.82 65.4,7.82 CON4.4 | 48.02,8.9
C_IN9
  Top 0.254: IC5.1 48.97,9.09 49.78,8.28 68.75,8.28 CON4.5
C_IN10
  Top 0.254: IC5.3 51.51,10.36 53.14,8.74 72.11,8.74 CON4.6
C_IN11
  Top 0.254: IC5.5 54.05,10.36 55.22,9.2 72.36,9.2 74.5,7.06 77.59,7.06 CON4.7
C_IN12
  Top 0.254: IC5.7 56.72,14.58 56.72,10.11 57.18,9.65 72.67,9.65 74.75,7.57 80.9,7.57 CON4.8
C_IN13  (via drill 0.5)
  Top 0.254: IC6.1 61.29,14.58 v61.29,12.14
  Bottom 0.254: v61.29,12.14 66.12,7.31 84.96,7.31 CON4.9
C_IN14  (via drill 0.5)
  Top 0.254: IC6.3 v64.08,11.89
  Bottom 0.254: v64.08,11.89 68.15,7.82 88.26,7.82 CON4.10
C_IN15  (via drill 0.5)
  Top 0.254: IC6.5 v66.62,11.89
  Bottom 0.254: v66.62,11.89 69.42,11.89 72.97,8.33 91.56,8.33 CON4.11
C_IN16  (via drill 0.5)
  Top 0.254: IC6.7 69.29,14.71 v69.29,12.9
  Bottom 0.254: v69.29,12.9 73.35,8.84 94.87,8.84 CON4.12
C_OUT1
  Top 0.61: Q6.6 83.13,76.3 Q6.5 CON2.5
C_OUT2
  Top 0.61: Q6.7 Q6.8 CON2.6
C_OUT3
  Top 0.61: Q7.6 Q7.5 CON2.7
C_OUT4
  Top 0.61: Q7.7 Q7.8 CON2.8
C_OUT5
  Top 0.61: Q8.6 Q8.5 CON2.9
C_OUT6
  Top 0.61: Q8.7 Q8.8 CON2.10
C_OUT7
  Top 0.61: Q9.6 Q9.5 CON2.11
C_OUT8
  Top 0.61: Q9.7 Q9.8 CON2.12
C_OUT9
  Top 0.61: Q1.6 Q1.5 CON1.1
C_OUT10
  Top 0.61: Q1.7 Q1.8 CON1.2
C_OUT11
  Top 0.61: Q2.6 Q2.5 CON1.3
C_OUT12
  Top 0.61: Q2.7 Q2.8 CON1.4
C_OUT13
  Top 0.61: Q3.6 30.63,76.17 Q3.5 CON1.5
C_OUT14
  Top 0.61: Q3.7 Q3.8 CON1.6
C_OUT15
  Top 0.61: Q4.6 Q4.5 CON1.7
C_OUT16
  Top 0.61: Q4.7 Q4.8 CON1.8
C_PWM1
  Top 0.61: Q5.6 Q5.5 CON1.9
C_PWM2
  Top 0.61: Q5.7 Q5.8 CON1.10
C_S0-IN3
  Top 0.254: CON3.6 22.3,5.99 22.3,7.19 20.9,7.19 19.63,8.46 17.98,8.46 17.09,9.35 OK2.1
C_S0-IN4
  Top 0.254: CON3.7 24.41,7.7 21.34,7.7 20.14,8.89 OK1.1
EN
  Top 0.254: R51.2 72.65,36.4 74.88,36.4 75.51,37.03 75.51,38.18 | SJ9.2 75.51,38.18 | 75.51,38.18 75.51,40.97 75.01,41.48 73.1,41.48 70.69,43.89 70.69,48.21 69.8,49.1 67.64,49.1 66.66,50.08 U3.TXCO_EN
GND  (via drill 0.5, 0.65)
  Top 0.22: SJ2.1 93.55,48.72 92.28,47.45 89.86,47.45 | SJ3.1 93.8,46.18 89.99,46.18 89.86,46.3 89.86,47.45 | 89.86,47.45 89.23,47.45 v88.85,47.83
  Top 0.305: R32.1 45.31,10.84 45.54,11.07 v46.94,11.07 | R31.1 43.38,10.86 v43.38,9.68 | R30.1 40.84,10.23 v40.84,9.42 | R29.1 37.67,9.97 38.22,9.42 v38.3,9.42 | R28.1 33.22,10.35 v33.22,9.68 | R27.1 30.68,10.35 v30.68,9.42 | R26.1 28.27,10.23 v28.27,9.55 | R25.1 v25.1,9.68 | SJ1.1 v93.93,52.91 | R23.1 18.62,9.47 v18.49,9.35 | R24.1 v21.92,9.09 | v18.87,22.3 18.87,21.48 OK2.3 | v21.92,22.17 21.92,21.48 OK1.3 | 62.81,21.29 IC6.15 62.81,22.17 63.96,23.32 v63.96,23.57 | 63.96,22.43 65.23,22.43 65.35,22.3 IC6.13 | IC6.9 70.43,21.79 69.8,22.43 67.77,22.43 67.77,20.85 IC6.11 | v89.23,43.64 89.23,44.02 | C6.2 77.99,49.93 77.29,50.62 v77.29,50.75 | C8.- 65.23,32.19 v65.23,32.84 | v64.34,32.84 v63.58,32.84
  Top 0.406: R51.1 69.37,37.48 U3.GND U3.GND@1
  Top 0.508: X1.17 55.79,23.11 v55.83,23.06
  Bottom 0.305: v79.83,43.64 v89.23,43.64 | 65.1,32.97 v65.23,32.84 v64.34,32.84
  other vias: 59.13,20.4 50.62,9.3 53.67,9.55 56.21,9.8 46.94,20.27 55.32,18.75 52.91,18.62 50.37,18.49 80.09,9.98 85.93,9.98 91.77,9.98 73.74,13.66 82.88,34.75 88.85,16.71 88.47,40.21 88.85,50.24 98.12,39.07 88.09,53.42 95.71,58.12 86.56,22.05
  pour Bottom (isolate 0.254): 0,85.45 0,0 102.45,0 102.45,85.45
  pour Top (isolate 0.254): 0,85.45 0,0 102.45,0 102.45,85.45
GPIO0
  Top 0.254: R50.1 U2.G0
  Bottom 0.254: U2.G0 91.37,40.73 arc45 89.57,41.48 71.88,41.48 arc-45 69.43,42.49 U3.INT
GPIO12
  Top 0.254: SJ9.3 77.16,36.14 76.15,35.13 U2.G12
GPIO18  (via drill 0.5)
  Top 0.254: v89.99,38.68 89.99,39.37 arc-45 91.9,43.97 v91.9,44.02
  Bottom 0.254: v91.9,44.02 92.24,44.36 arc-45 94.47,45.29 U2.G18 | v89.99,38.68 89.74,38.94 72.16,38.94 arc-45 69.23,40.15 U3.MDIO
GPIO21
  Bottom 0.254: U2.G21 96.89,52.91 arc45 95.09,52.16 92.77,49.84 arc-45 90.97,49.1 71.54,49.1 arc45 69.75,48.35 U3.TX_EN
GPIO23
  Bottom 0.254: U2.G23 91.37,54.92 arc-45 89.57,54.18 68.06,54.18 arc45 66.26,53.43 64.95,52.13 arc45 64.21,50.33 64.21,43.8 arc45 65.03,41.81 U3.MDC
GPIO27
  Bottom 0.254: U2.G27 72.01,40.21 arc-45 70.84,40.7 70.63,40.9 arc45 69.24,41.48 68.96,41.48 arc-45 67.16,42.22 U3.CRS
IN1  (via drill 0.5)
  Top 0.254: IC3.16 23.95,20.73 23.95,26.24 v25.48,27.76 27.76,30.05 54.94,30.05 55.29,29.7 X1.16 | IC9.28 v89.61,28.65
  Bottom 0.254: v25.48,27.76 25.91,28.2 65.17,28.2 65.35,28.02 70.56,28.02 72.34,26.24 75.77,26.24 78.18,28.65 v89.61,28.65
IN2  (via drill 0.5)
  Top 0.254: IC9.27 v89.61,27.38 | X1.14 54.29,29.43 54.05,29.67 28.91,29.67 v26.37,27.13 IC3.14
  Bottom 0.254: v89.61,27.38 77.67,27.38 76.78,26.49 76.78,24.97 75.51,23.7 71.58,23.7 70.94,24.33 70.94,27 70.43,27.51 65.32,27.51 65.01,27.82 27.05,27.82 v26.37,27.13
IN3  (via drill 0.5)
  Top 0.254: IC9.26 v89.61,26.11 | X1.12 53.29,29.04 53.04,29.29 31.83,29.29 v28.91,26.37 IC3.12
  Bottom 0.254: v89.61,26.11 78.82,26.11 78.69,26.11 77.93,25.35 77.93,23.95 75.13,21.16 72.85,21.16 70.31,23.7 70.31,26.62 69.93,27 64.97,27 64.54,27.44 29.98,27.44 v28.91,26.37
IN4  (via drill 0.5)
  Top 0.254: IC9.25 v89.61,24.84 | X1.10 52.27,27.27 52.27,28.91 33.48,28.91 32.46,27.89 32.46,26.62 | 32.46,26.62 v32.52,26.68 | 32.46,26.62 31.45,25.6 IC3.10
  Bottom 0.254: v89.61,24.84 81.23,24.84 81.23,23.32 76.53,18.62 72.34,18.62 72.08,18.87 72.08,21.03 69.67,23.44 69.67,26.49 69.54,26.62 64.81,26.62 64.38,27.05 32.9,27.05 v32.52,26.68
IN5  (via drill 0.5)
  Top 0.254: IC9.1 75.13,28.65 75.01,28.78 73.23,28.78 70.43,25.98 v69.04,25.98 | X1.8 51.26,27.29 51.26,28.52 37.41,28.52 36.52,27.64 v36.52,25.91 IC4.16
  Bottom 0.254: v36.52,25.91 37.29,26.67 64.03,26.67 64.72,25.98 v69.04,25.98
IN6  (via drill 0.5)
  Top 0.254: IC9.2 76.91,27.38 75.77,26.24 72.72,26.24 71.83,25.35 v68.27,25.35 | X1.6 50.24,27.21 50.24,25.48 45.29,25.48 43.13,23.32 39.07,23.32 | 39.07,23.32 39.07,24.71 v39.83,25.48 | 39.07,23.32 IC4.14
  Bottom 0.254: v68.27,25.35 67.64,25.35 67.39,25.6 64.56,25.6 63.93,26.24 40.59,26.24 v39.83,25.48
IN7  (via drill 0.5)
  Top 0.254: IC9.3 77.93,26.11 75.51,23.7 72.47,23.7 71.39,24.77 67.27,24.77 67.2,24.84 v66.62,24.84 | IC4.12 v41.61,22.3 | X1.4 49.29,25.92 49.23,25.86 42.75,25.86 v41.61,24.71
  Bottom 0.254: v41.61,22.3 v41.61,24.71 42.75,25.86 63.7,25.86 64.72,24.84 v66.62,24.84
IN8  (via drill 0.5)
  Top 0.254: IC9.4 78.69,24.84 75.01,21.16 73.1,21.16 71.83,22.43 71.83,23.57 71.32,24.08 v68.66,24.08 | IC4.10 v44.15,22.17 | X1.2 48.29,26.31 48.21,26.24 41.86,26.24 40.84,25.22 40.84,24.21 40.97,24.08 v42.75,24.08
  Bottom 0.254: v68.66,24.08 68.47,24.26 64.76,24.26 63.55,25.48 46.05,25.48 44.15,23.57 v44.15,22.17 44.15,22.68 v42.75,24.08
IN9
  Top 0.254: IC9.8 78.69,19.76 75.51,16.59 50.24,16.59 48.97,17.86 48.97,20.4 IC5.16 48.97,21.03 48.84,21.16 48.08,21.16 47.79,21.46 X1.1
IN10
  Top 0.254: IC9.7 79.07,21.03 75.26,17.22 52.83,17.22 51.51,18.54 IC5.14 51.51,21.67 51.38,21.79 48.97,21.79 48.79,21.98 X1.3
IN11
  Top 0.254: IC9.6 79.45,22.3 75.01,17.86 54.05,17.86 IC5.12 54.05,21.79 51.92,21.79 51.54,22.17 49.86,22.17 49.79,22.25 X1.5
IN12
  Top 0.254: IC9.5 79.83,23.57 74.75,18.49 56.58,18.49 56.59,18.52 IC5.10 56.59,21.79 54.81,21.79 54.43,22.17 52.08,22.17 51.7,22.55 51,22.55 50.79,22.77 X1.7
IN13  (via drill 0.5)
  Top 0.254: IC6.16 v61.54,19.25 | v89.61,19.76 IC9.21 | X1.9 51.89,24.35 51.89,23.32 v51.77,23.19
  Bottom 0.254: v89.61,19.76 86.05,16.21 64.59,16.21 v61.54,19.25 61.54,21.16 53.8,21.16 v51.77,23.19
IN14  (via drill 0.5)
  Top 0.254: IC6.14 v64.08,19.13 | v89.61,21.03 IC9.22 | X1.11 52.79,23.45 52.78,23.44 v52.78,23.06
  Bottom 0.254: v89.61,21.03 85.17,16.59 66.62,16.59 v64.08,19.13 64.08,21.54 54.3,21.54 v52.78,23.06
IN15  (via drill 0.5)
  Top 0.254: IC6.12 v66.62,19.25 | v89.61,22.3 IC9.23 | X1.13 53.8,24.45 v53.8,23.06
  Bottom 0.254: v89.61,22.3 84.4,17.09 68.78,17.09 v66.62,19.25 66.62,21.79 66.5,21.92 54.69,21.92 53.8,22.81 v53.8,23.06
IN16  (via drill 0.5)
  Top 0.254: IC6.10 v69.16,19.13 | v89.61,23.57 IC9.24 | X1.15 54.81,24.43 v54.81,23.06
  Bottom 0.254: v89.61,23.57 83.64,17.6 70.69,17.6 v69.16,19.13 69.16,22.05 68.91,22.3 54.94,22.3 54.94,22.94 v54.81,23.06
LED  (via drill 0.5)
  Top 0.305: X1.19 56.79,23.12 v56.84,23.06 | R53.2 94.88,41.04 94.44,40.59 94.31,40.59 86.56,32.84 v86.56,23.7
  Bottom 0.305: v56.84,23.06 57.1,22.81 69.29,22.81 71.2,20.9 71.2,18.62 71.7,18.11 78.43,18.11 83.13,22.81 83.13,23.44 83.39,23.7 v86.56,23.7
LED1  (via drill 0.5)
  Top 0.254: U2.G5 96.85,42.75 | 96.85,42.75 R53.1 | SJ9.1 77.29,39.83 v78.94,39.83 | v91.01,39.57 92.41,40.97 92.41,42.62 93.67,43.89 96.72,43.89 96.85,43.76 96.85,42.75
  Bottom 0.254: v78.94,39.83 79.32,39.83 79.7,39.45 90.5,39.45 90.63,39.57 v91.01,39.57
N$1
  Top 0.254: IC9.15 93.67,12.14 94.69,11.12 SJ6.2
N$2
  Top 0.254: IC8.16 92.61,46.81 93.12,47.32 95.07,47.32 95.45,47.7 SJ2.2
N$3
  Top 0.254: Q1.2 R2.2
N$4
  Top 0.254: Q1.4 R1.2
N$5
  Top 0.254: IC8.18 91.64,49.35 92.53,50.24 92.53,53.16 93.67,54.3 R46.1
N$6
  Top 0.254: IC9.18 92.28,15.95 92.79,16.46 92.79,21.92 93.99,23.12 R52.1
N$7
  Top 0.254: IC8.15 92.28,45.54 93.04,44.78 95.07,44.78 95.45,45.16 SJ3.2
N$8
  Top 0.254: Q5.4 15.47,67.93 R9.2
N$9
  Top 0.254: Q5.2 12.93,67.93 R10.2
N$10
  Top 0.254: SJ5.2 88.85,12.14 90.12,13.41 IC9.16
N$11
  Top 0.305: IC3.2 R25.2
N$12
  Top 0.305: IC3.4 R26.2
N$13
  Top 0.305: IC3.6 R27.2
N$14
  Top 0.305: IC3.8 R28.2
N$15
  Top 0.305: IC4.2 37.8,12.89 R29.2
N$16
  Top 0.305: IC4.4 40.34,12.89 R30.2
N$17
  Top 0.305: IC4.6 42.88,12.89 R31.2
N$18
  Top 0.305: IC4.8 45.41,12.89 R32.2
N$19
  Top 0.305: IC5.2 R33.2
N$20
  Top 0.305: IC5.4 R34.2
N$21
  Top 0.305: IC5.6 R35.2
N$22
  Top 0.305: IC5.8 R36.2
N$23
  Top 0.305: IC6.2 R37.2
N$24
  Top 0.305: IC6.4 R38.2
N$25
  Top 0.305: IC6.6 R39.2
N$26
  Top 0.305: IC6.8 70.81,14.45 R40.2
N$27
  Top 0.254: SJ4.2 83.01,11.76 85.93,14.68 IC9.17
N$28
  Top 0.254: Q2.4 R3.2
N$29
  Top 0.254: Q2.2 R4.2
N$30
  Top 0.254: IC8.17 92.15,48.08 92.41,48.34 92.41,49.23 93.29,50.11 95.2,50.11 95.45,50.37 SJ1.2
N$31
  Top 0.254: OK2.2 18.36,13.01 R23.2
N$32
  Top 0.254: Q3.4 R5.2
N$33
  Top 0.254: Q3.2 R6.2
N$34
  Top 0.254: R11.1 14.3,12.33 R21.1 15.7,10.68 15.7,5.42 CON3.4
N$35  (via drill 0.5)
  other vias: 60.02,31.06
N$36
  Top 0.254: Q4.4 R7.2
N$37
  Top 0.254: Q4.2 R8.2
N$38  (via drill 0.5)
  other vias: 11.63,72.47
N$39  (via drill 0.5)
  other vias: 14.17,72.47
N$40
  Top 0.254: Q6.4 R13.2
N$41
  Top 0.254: Q6.2 R14.2
N$42  (via drill 0.5)
  other vias: 19.25,72.47
N$43  (via drill 0.5)
  other vias: 21.79,72.47
N$44
  Top 0.254: Q7.4 75.54,68.93 76.77,67.7 R15.2
N$45
  Top 0.254: R16.2 71.18,67.7 73,69.52 Q7.2
N$46  (via drill 0.5)
  other vias: 26.87,72.47
N$47  (via drill 0.5)
  other vias: 29.41,72.47
N$48
  Top 0.254: Q8.4 67.54,69.9 R17.2
N$49
  Top 0.254: Q8.2 65.38,68.59 R18.2
N$50  (via drill 0.5)
  other vias: 34.49,72.47
N$51  (via drill 0.5)
  other vias: 37.03,72.47
N$52
  Top 0.254: Q9.4 R19.2
N$53
  Top 0.254: Q9.2 R20.2
N$54  (via drill 0.5)
  other vias: 42.11,72.47
N$55  (via drill 0.5)
  other vias: 44.65,72.47
N$56  (via drill 0.5)
  other vias: 48.46,73.1
N$57
  Top 0.254: OK1.2 21.41,13.14 R24.2
N$58  (via drill 0.5)
  other vias: 47.45,72.34
N$59  (via drill 0.5)
  other vias: 47.32,70.81
N$60  (via drill 0.5)
  other vias: 56.46,72.47
N$61  (via drill 0.5)
  other vias: 59,72.59
N$62  (via drill 0.5)
  other vias: 64.08,72.47
N$63  (via drill 0.5)
  other vias: 66.62,72.47
N$64  (via drill 0.5)
  other vias: 71.7,72.47
N$65  (via drill 0.5)
  other vias: 74.24,72.47
N$66  (via drill 0.5)
  other vias: 79.32,72.47
N$67  (via drill 0.5)
  other vias: 81.86,72.47
N$68  (via drill 0.5)
  other vias: 12.14,8.33
N$69  (via drill 0.5)
  other vias: 12.14,9.86
N$70  (via drill 0.5)
  other vias: 9.22,83.13
N$71  (via drill 0.5)
  other vias: 6.93,83.01
N$72  (via drill 0.5)
  other vias: 83.52,37.03
N$73  (via drill 0.5)
  other vias: 83.77,35.13
N$74  (via drill 0.5)
  other vias: 83.13,40.46
N$75  (via drill 0.5)
  other vias: 82.12,42.75
N$76  (via drill 0.5)
  other vias: 83.26,42.75
N$77  (via drill 0.5)
  other vias: 88.72,42.49
N$78  (via drill 0.5)
  other vias: 63.2,40.97
N$79  (via drill 0.5)
  other vias: 63.2,39.57
N$80  (via drill 0.5)
  other vias: 62.18,40.21
OUT1  (via drill 0.5)
  Top 0.254: R13.1 83.03,65.67 83.03,64.36 v82.88,64.21 | IC8.27 v89.61,60.78 | v68.97,68.97 68.97,64.91 v68.72,64.66 | v66.12,62.56 66.12,60.95 X2.22
  Bottom 0.254: v89.61,60.78 88.98,60.78 85.55,64.21 v82.88,64.21 82.63,64.47 82.63,66.88 81.86,67.64 73.03,67.64 72.83,67.44 68.97,67.44 v68.97,68.97 | v68.72,64.66 66.62,62.56 v66.12,62.56
OUT2  (via drill 0.5)
  Top 0.254: R14.1 80.62,64.11 v80.47,63.96 | IC8.26 v89.61,59.51 | v63.07,66.88 62.81,66.88 62.81,64.97 65.16,62.63 X2.20
  Bottom 0.254: v89.61,59.51 89.23,59.51 85.29,63.45 80.97,63.45 v80.47,63.96 79.83,64.59 79.83,66.62 79.2,67.26 73.19,67.26 72.99,67.06 63.76,67.06 63.58,66.88 v63.07,66.88
OUT3  (via drill 0.5)
  Top 0.254: R15.1 78.08,64.24 v77.8,63.96 77.8,64.21 76.53,65.48 76.53,67.13 75.64,68.02 74.37,68.02 74.24,67.89 73.07,67.89 71.7,66.53 71.7,65.35 v70.56,64.21 | IC8.25 v89.61,58.24 | X2.18 64.21,60.86 64.21,59.89 67.89,59.89 v68.66,60.66
  Bottom 0.254: v77.8,63.96 77.8,63.7 79.83,61.67 85.67,61.67 89.1,58.24 v89.61,58.24 | v68.66,60.66 69.04,61.04 69.04,62.56 70.56,64.08 v70.56,64.21
OUT4  (via drill 0.5)
  Top 0.254: v72.97,68.53 72.91,68.59 71.32,67 71.32,65.99 71.13,65.8 R16.1 70.2,65 69.42,64.21 v69.42,63.96 | v89.61,62.05 IC8.28 | v63.07,62.43 63.16,62.34 X2.16
  Bottom 0.254: v72.97,68.53 73.48,68.02 82.88,68.02 88.72,62.18 89.48,62.18 v89.61,62.05 | v69.42,63.96 67.39,61.93 63.58,61.93 v63.07,62.43
OUT5  (via drill 0.5)
  Top 0.254: IC8.1 78.69,62.05 78.56,62.05 77.16,62.05 76.28,62.94 76.28,63.77 76.02,64.02 76.02,66.62 75.13,67.51 73.23,67.51 72.08,66.37 72.08,64.72 70.69,63.32 68.91,63.32 67.54,64.69 R17.1 67.1,66.24 66.62,66.24 65.99,66.88 65.99,68.02 v66.05,68.08 | v62.56,68.66 62.16,68.25 X2.14
  Bottom 0.254: v66.05,68.08 65.35,68.78 62.69,68.78 v62.56,68.66
OUT6  (via drill 0.5)
  Top 0.254: v64.85,64.21 64.49,64.57 R18.1 65.41,65.8 68.27,62.94 71.07,62.94 72.59,64.47 72.59,66.12 73.48,67 74.88,67 75.51,66.37 75.51,63.99 75.89,63.61 75.89,62.56 77.67,60.78 IC8.2 | v61.16,62.43 X2.12
  Bottom 0.254: v64.85,64.21 64.21,63.58 61.16,63.58 v61.16,62.43
OUT7  (via drill 0.5)
  Top 0.254: R19.1 60.3,64.31 60.15,64.16 v60.15,62.43 v60.16,62.42 X2.10 | v65.99,63.7 66.24,63.96 66.62,63.96 68.02,62.56 71.45,62.56 73.23,64.34 74.62,64.34 75.51,63.45 75.51,62.05 78.05,59.51 IC8.3
  Bottom 0.254: v65.99,63.7 65.35,63.07 62.05,63.07 62.05,61.42 60.15,61.42 v60.15,62.43
OUT8  (via drill 0.5)
  Top 0.254: R20.1 57.76,63.8 v59.13,62.43 59.16,62.41 X2.8 | IC8.4 78.43,58.24 74.88,61.8 73.1,61.8 72.85,61.8 72.47,62.18 68.66,62.18 v68.27,61.8
  Bottom 0.254: v68.27,61.8 67.39,60.91 59.13,60.91 v59.13,62.43
OUT9  (via drill 0.5)
  Top 0.254: IC8.5 77.42,56.97 75.13,59.26 73.61,59.26 71.2,61.67 70.69,61.67 v68.66,59.64 | R1.1 45.95,64.69 46.18,64.47 55.96,64.47 v57.99,62.43 58.16,62.26 X2.6
  Bottom 0.254: v68.66,59.64 68.15,59.64 67.26,60.53 57.99,60.53 v57.99,62.43
OUT10  (via drill 0.5)
  Top 0.254: IC8.6 76.4,55.7 75.39,56.72 73.35,56.72 72.47,57.61 72.47,59.64 71.83,60.27 70.31,60.27 v68.66,58.62 | R2.1 43.41,64.69 44.02,64.08 55.7,64.08 56.97,62.81 v56.97,62.43 57.16,62.25 X2.4
  Bottom 0.254: v68.66,58.62 68.53,58.62 67,60.15 57.48,60.15 56.97,60.66 v56.97,62.43
OUT11  (via drill 0.5)
  Top 0.254: IC8.24 v89.61,56.97 | R3.1 38.33,64.34 38.96,63.7 55.19,63.7 56.08,62.81 v56.08,62.43 56.08,60.99 X2.2
  Bottom 0.254: v89.61,56.97 89.36,56.97 85.17,61.16 79.07,61.16 75.89,64.34 72.21,64.34 70.18,62.31 70.18,60.15 69.24,59.2 69.24,58.38 68.9,58.04 68.35,58.04 66.62,59.77 56.46,59.77 56.21,60.02 56.21,62.05 56.08,62.18 v56.08,62.43
OUT12  (via drill 0.5)
  Top 0.254: IC8.23 v89.61,55.7 | R4.1 35.79,64.44 37.54,62.69 v52.78,62.69 | v65.61,56.72 65.61,58.06 X2.21
  Bottom 0.254: v89.61,55.7 84.72,60.59 77.23,60.59 76.02,61.8 72.97,61.8 69.62,58.44 69.62,58.23 68.24,56.84 65.61,56.84 | 65.61,56.84 65.61,59.26 65.48,59.38 56.31,59.38 55.83,59.86 55.83,59.89 55.7,60.02 55.7,61.8 55.32,62.18 53.29,62.18 v52.78,62.69 | 65.61,56.84 v65.61,56.72
OUT13  (via drill 0.5)
  Top 0.254: v88.47,55.7 89.74,54.43 IC8.22 | R5.1 30.37,65.8 30.3,65.73 33.73,65.73 37.67,61.8 v52.27,61.8 | v64.72,56.72 64.66,56.78 X2.19
  Bottom 0.254: v88.47,55.7 84.91,59.26 71.45,59.26 68.53,56.34 66.24,56.34 65.86,55.96 65.35,55.96 64.72,56.59 v64.72,56.72 64.59,56.84 64.59,58.5 64.21,58.88 56.21,58.88 55.07,60.02 55.07,61.54 54.94,61.67 52.4,61.67 v52.27,61.8
OUT14  (via drill 0.5)
  Top 0.254: IC8.21 89.86,53.16 v87.32,55.7 | R6.1 28.17,65.2 28.59,64.78 33.92,64.78 37.54,61.16 v51.26,61.16 | v63.7,56.72 63.66,56.76 X2.17
  Bottom 0.254: v87.32,55.7 86.31,56.72 69.54,56.72 68.66,55.83 66.5,55.83 66.12,55.45 64.97,55.45 v63.7,56.72 63.7,58.37 63.58,58.5 55.96,58.5 54.56,59.89 54.56,61.16 v51.26,61.16
OUT15  (via drill 0.5)
  Top 0.254: IC8.7 75.51,54.43 75.26,54.18 65.1,54.18 62.66,56.62 v62.66,56.72 X2.15 | R7.1 26.17,65.8 27.76,64.21 33.73,64.21 37.41,60.53 v52.53,60.53
  Bottom 0.254: v62.66,56.72 62.66,57.89 62.43,58.12 55.8,58.12 53.38,60.53 v52.53,60.53
OUT16  (via drill 0.5)
  Top 0.254: IC8.8 76.53,53.16 75.01,51.64 73.1,51.64 72.47,52.27 72.47,53.29 71.96,53.8 64.59,53.8 v61.67,56.72 61.66,56.73 X2.13 | R8.1 20.55,65.2 21.03,64.72 26.49,64.72 27.51,63.7 33.48,63.7 37.29,59.89 v51.26,59.89
  Bottom 0.254: v61.67,56.72 61.54,56.84 61.54,57.61 61.42,57.73 55.32,57.73 53.16,59.89 v51.26,59.89
PAIR1_N
  Bottom 0.254: U2.G26 73.32,43.54 arc45 72.18,44.02 68.96,44.02 arc-45 67.16,44.76 U3.RX1
PAIR1_P
  Bottom 0.254: U3.RX0 74.09,45.27 U2.G25
PAIR2_N
  Bottom 0.254: U2.G22 91.37,52.38 arc-45 89.57,51.64 71.54,51.64 arc45 69.75,50.89 U3.TX1
PAIR2_P
  Bottom 0.254: U2.G19 98.99,47.3 arc-45 97.19,46.56 68.96,46.56 arc-45 67.16,47.3 U3.TX0
PWM1  (via drill 0.5)
  Top 0.254: v81.36,32.33 81.36,40.21 75.01,46.56 72.97,46.56 72.59,46.94 72.59,51.38 70.56,53.42 63.96,53.42 v60.66,56.72 X2.11 | R9.1 17.66,66.69 20.14,64.21 26.24,64.21 27.25,63.2 33.22,63.2 37.16,59.26 v52.27,59.26
  Bottom 0.254: v81.36,32.33 97.23,32.33 U2.G2 | v60.66,56.72 60.66,57.35 55.16,57.35 53.77,58.75 52.78,58.75 v52.27,59.26
PWM2  (via drill 0.5)
  Top 0.254: v80.47,37.92 80.47,40.34 76.78,44.02 72.59,44.02 72.08,44.53 72.08,51.13 70.18,53.04 63.2,53.04 v59.64,56.59 59.64,58.09 X2.9 | v95.07,35.13 U2.G4 | R10.1 11.32,66.68 11.76,66.24 17.35,66.24 19.89,63.7 25.98,63.7 27,62.69 32.97,62.69 37.03,58.62 v51.26,58.62
  Bottom 0.254: v95.07,35.13 92.28,37.92 v80.47,37.92 | v59.64,56.59 59.38,56.84 54.94,56.84 53.42,58.37 52.62,58.37 52.37,58.62 v51.26,58.62
RX  (via drill 0.5)
  Top 0.254: SJ7.2 11.12,20.52 11,20.65 11,23.19 11.51,23.7 v15.32,23.7
  Bottom 0.254: v15.32,23.7 15.82,24.21 17.09,24.21 17.35,24.46 SV1.6
RX2  (via drill 0.5)
  Top 0.254: U2.G16 93.42,37.67 90.37,34.62 90.37,33.35 90.12,33.1 v89.99,33.1 | v23.57,29.29 23.44,29.16 17.22,29.16 16.08,28.02 16.08,23.19 15.57,22.68 14.81,22.68 14.68,22.55 SJ8.3
  Top 0.406: SJ7.3 SJ8.3
  Bottom 0.254: v89.99,33.1 85.17,33.1 84.98,32.91 77.87,32.91 76.28,31.32 73.1,31.32 72.21,30.43 72.21,29.92 71.96,29.67 63.76,29.67 63.69,29.74 58.55,29.74 58.12,30.18 24.46,30.18 v23.57,29.29
S0-3  (via drill 0.5)
  Top 0.254: v63.45,29.16 64.21,29.16 64.27,29.22 | OK2.4 17.09,21.54 19.38,23.83 22.81,23.83 v23.19,24.21 | X1.20 v57.29,29.16 | v83.26,31.32 82.12,32.46 v82.12,37.03
  Top 0.305: 64.27,29.22 64.97,29.92 64.97,30.68 v64.72,30.94 | v96.98,29.79 96.98,27.7 R43.1
  Bottom 0.254: v63.45,29.16 v57.29,29.16 57.29,29.71 57.3,29.72 25.22,29.72 23.95,28.45 23.95,24.46 23.7,24.21 v23.19,24.21 | 96.98,30.94 96.6,31.32 v83.26,31.32 | v82.12,37.03 74.75,37.03 U2.G14
  Bottom 0.305: U2.G14 72.47,37.67 72.34,37.54 72.47,37.41 72.47,34.87 71.58,33.98 71.58,31.95 70.69,31.06 64.85,31.06 v64.72,30.94 | v96.98,29.79 96.98,30.94
S0-4  (via drill 0.5)
  Top 0.254: R44.1 78.12,30.56 v77.04,30.56 | OK1.4 19.89,21.22 19.89,22.55 20.65,23.32 v23.19,23.32 | X1.18 v56.29,29.14
  Bottom 0.254: 77.55,30.05 v77.04,30.56 77.04,29.54 76.28,28.78 65.35,28.78 65.16,28.58 56.34,28.58 | v23.19,23.32 24.33,23.32 24.59,23.57 24.59,28.07 25.1,28.58 56.34,28.58 | v56.29,29.14 56.29,28.63 56.34,28.58
  Bottom 0.305: U2.G15 98.25,28.78 94.18,28.78 92.91,30.05 77.55,30.05
SCL  (via drill 0.5)
  Top 0.254: U2.G32 75.89,50.37 78.18,48.08 IC8.12 84.66,48.08 | 84.66,48.08 84.66,58.75 88.98,63.07 88.98,65.99 87.83,67.13 IC7.7 | 84.66,48.08 84.66,15.32 84.02,14.68 IC9.12 76.91,14.68 76.53,14.3 R45.1 | X2.7 58.66,57.01 58.62,56.97 58.62,56.72 62.81,52.53 70.05,52.53 71.45,51.13 v71.45,50.75
  Bottom 0.254: v71.45,50.75 73.74,50.75 U2.G32
SCL_X
  Top 0.254: R48.1 89.48,78.85 CON2.3
  Top 0.305: R48.1 90.31,76.59 91.58,75.32 D4.1 91.58,72.28 88.98,69.67 IC7.5 IC7.6
SDA  (via drill 0.5)
  Top 0.254: U2.G33 77.16,47.83 78.18,46.81 IC8.13 | IC7.1 91.79,65.25 85.17,58.62 85.17,48.34 v85.55,47.95 85.17,47.57 85.17,15.06 83.52,13.41 IC9.13 79.31,13.41 R47.1 | X2.5 57.66,57.05 62.69,52.02 69.67,52.02 70.69,51 70.69,49.1 71.45,48.34 v71.45,48.21
  Bottom 0.254: v85.55,47.95 74.24,47.95 U2.G33 73.74,48.21 v71.45,48.21
SDA_X
  Top 0.254: CON2.2 95.58,79.16 R49.1
  Top 0.305: R49.1 94.75,76.59 93.48,75.32 D4.2 93.48,69.1 92.79,68.4 IC7.3 IC7.2
TEMP1
  Top 0.254: R11.2 14.17,14.81 16.59,17.22 16.59,19.89 16.46,20.02 16.46,21.67 19.13,24.33 21.03,24.33 21.16,24.46 21.16,27.89 21.67,28.4 24.97,28.4 27.51,30.94 56.34,30.94 56.59,31.19 56.59,32.84 57.35,33.6
  Top 0.305: 57.35,33.6 68.66,33.6 68.91,33.35 68.91,29.67 69.29,29.29 73.35,29.29 U2.G13
TX
  Top 0.254: SJ8.2 14.81,20.65 15.82,20.65 15.95,20.78 15.95,22.05 16.21,22.3 16.33,22.3 19.89,25.86 SV1.7
TX2  (via drill 0.4, 0.5)
  Top 0.254: v89.61,34.49 95.33,40.21 U2.G17 | v77.29,34.11 75.39,34.11 75.13,33.86 72.85,33.86 72.47,33.48 v72.47,32.46 | v14.55,17.35 14.55,18.87 SJ8.1
  Top 0.406: SJ7.1 SJ8.1
  Bottom 0.254: v89.61,34.49 85.55,34.49 84.66,33.6 | v79.32,33.86 77.55,33.86 v77.29,34.11 | v72.47,32.46 72.34,32.33 72.34,31.57 70.94,30.18 58.75,30.18 58.24,30.68 23.83,30.68 21.16,28.02 21.16,22.43 15.82,17.09 14.81,17.09 v14.55,17.35
  Bottom 0.305: 84.66,33.6 79.7,33.6 79.45,33.86 v79.32,33.86
VCC
  Top 0.61: CON1.12 4.04,75.13 4.12,75.21 D1.A